# EAGLE board ALU (EAGLE 9.6.2), part 1 of 2
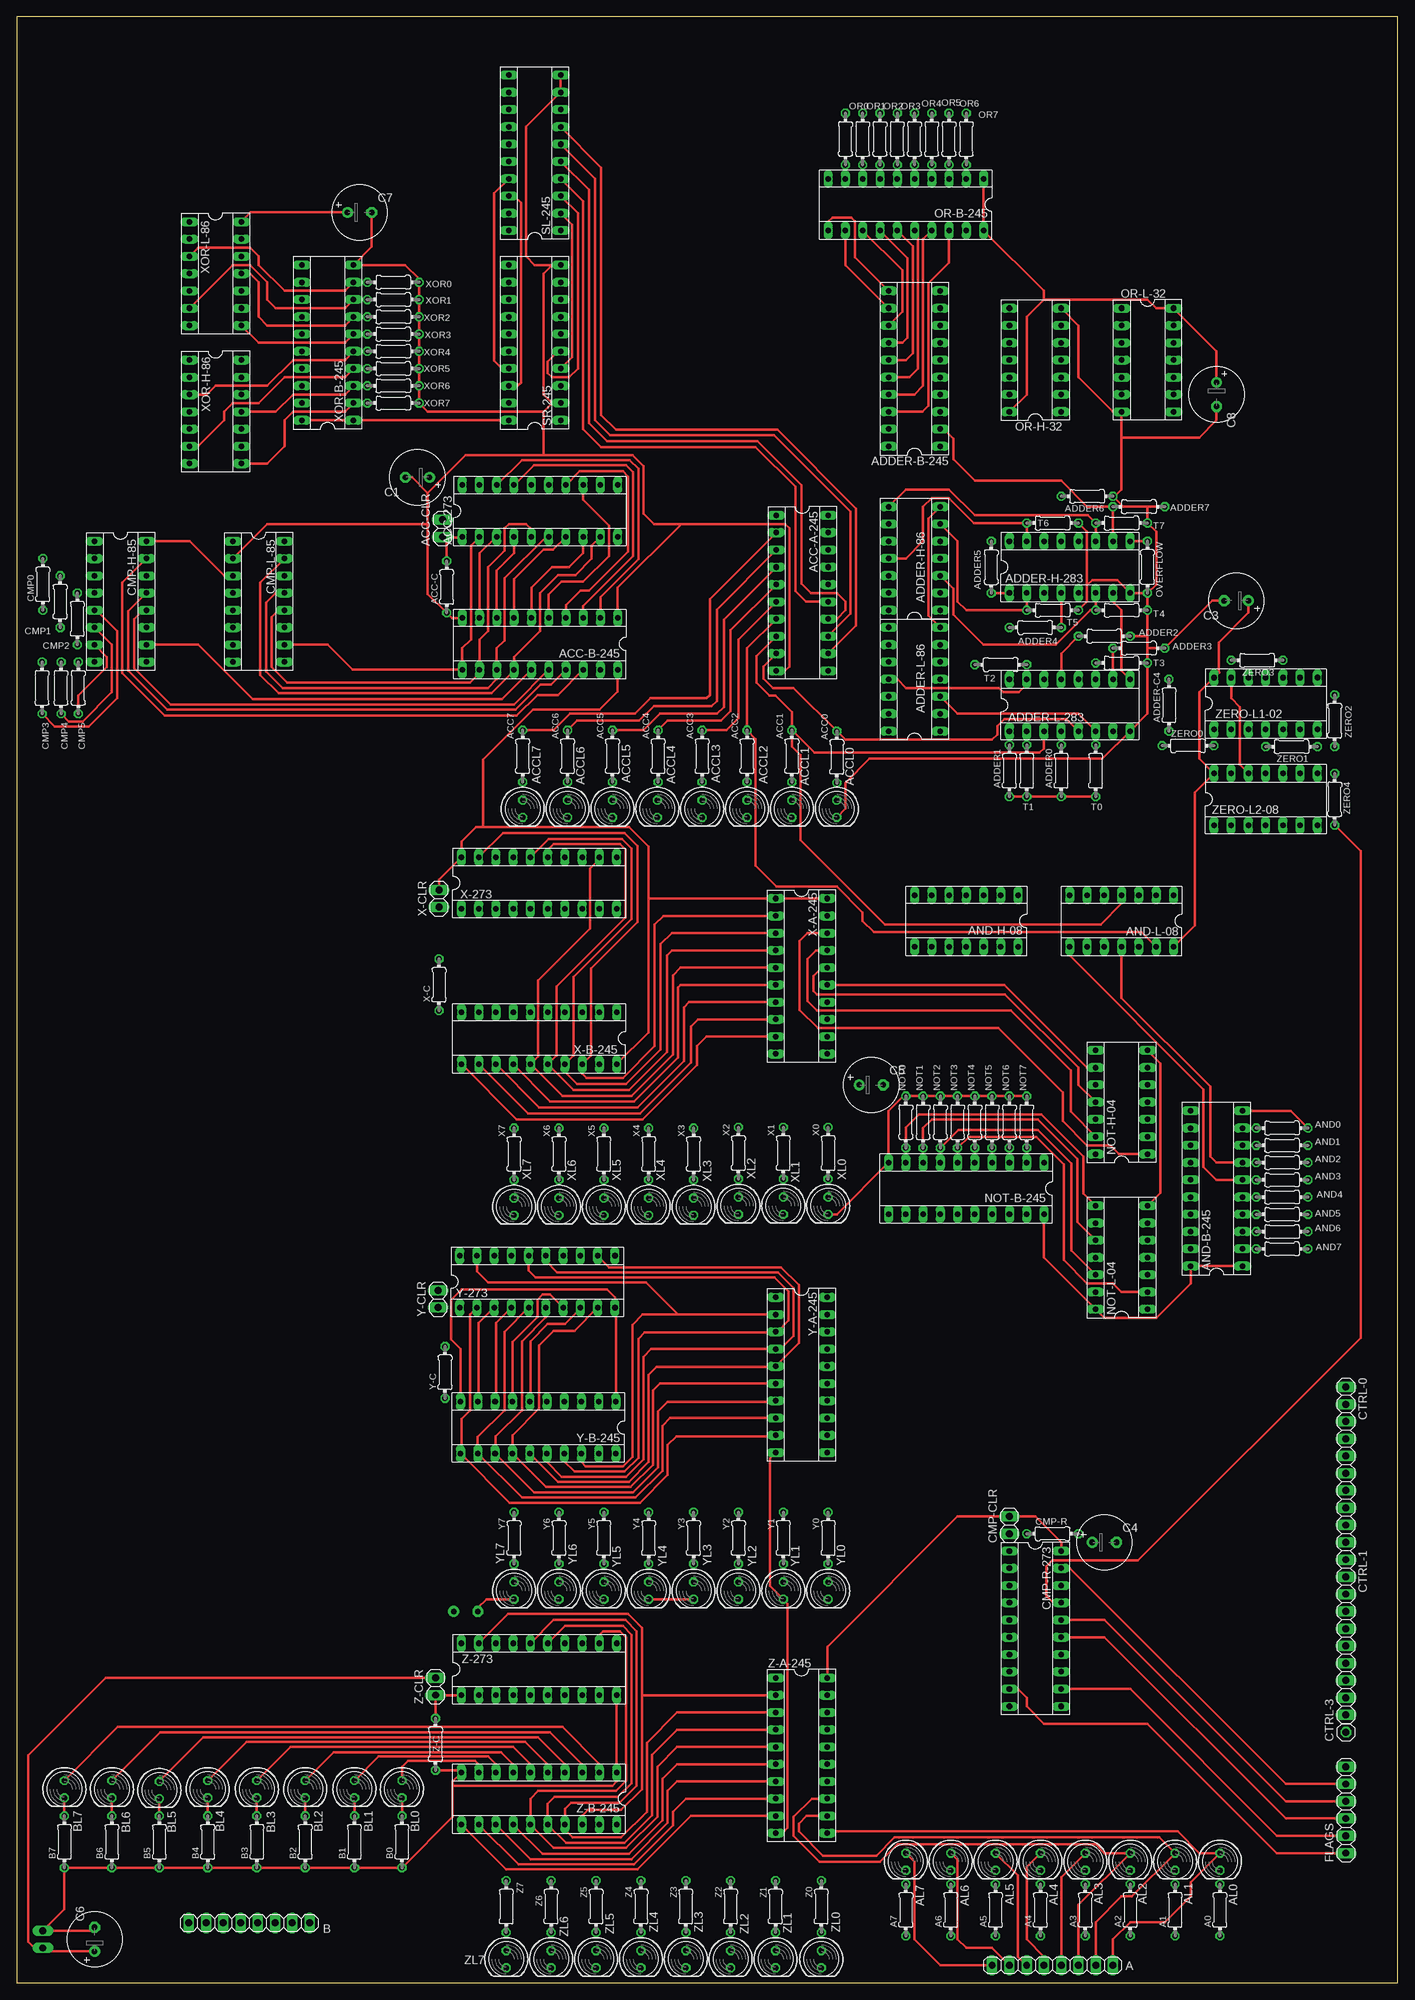
[diagram p8: board, top side]
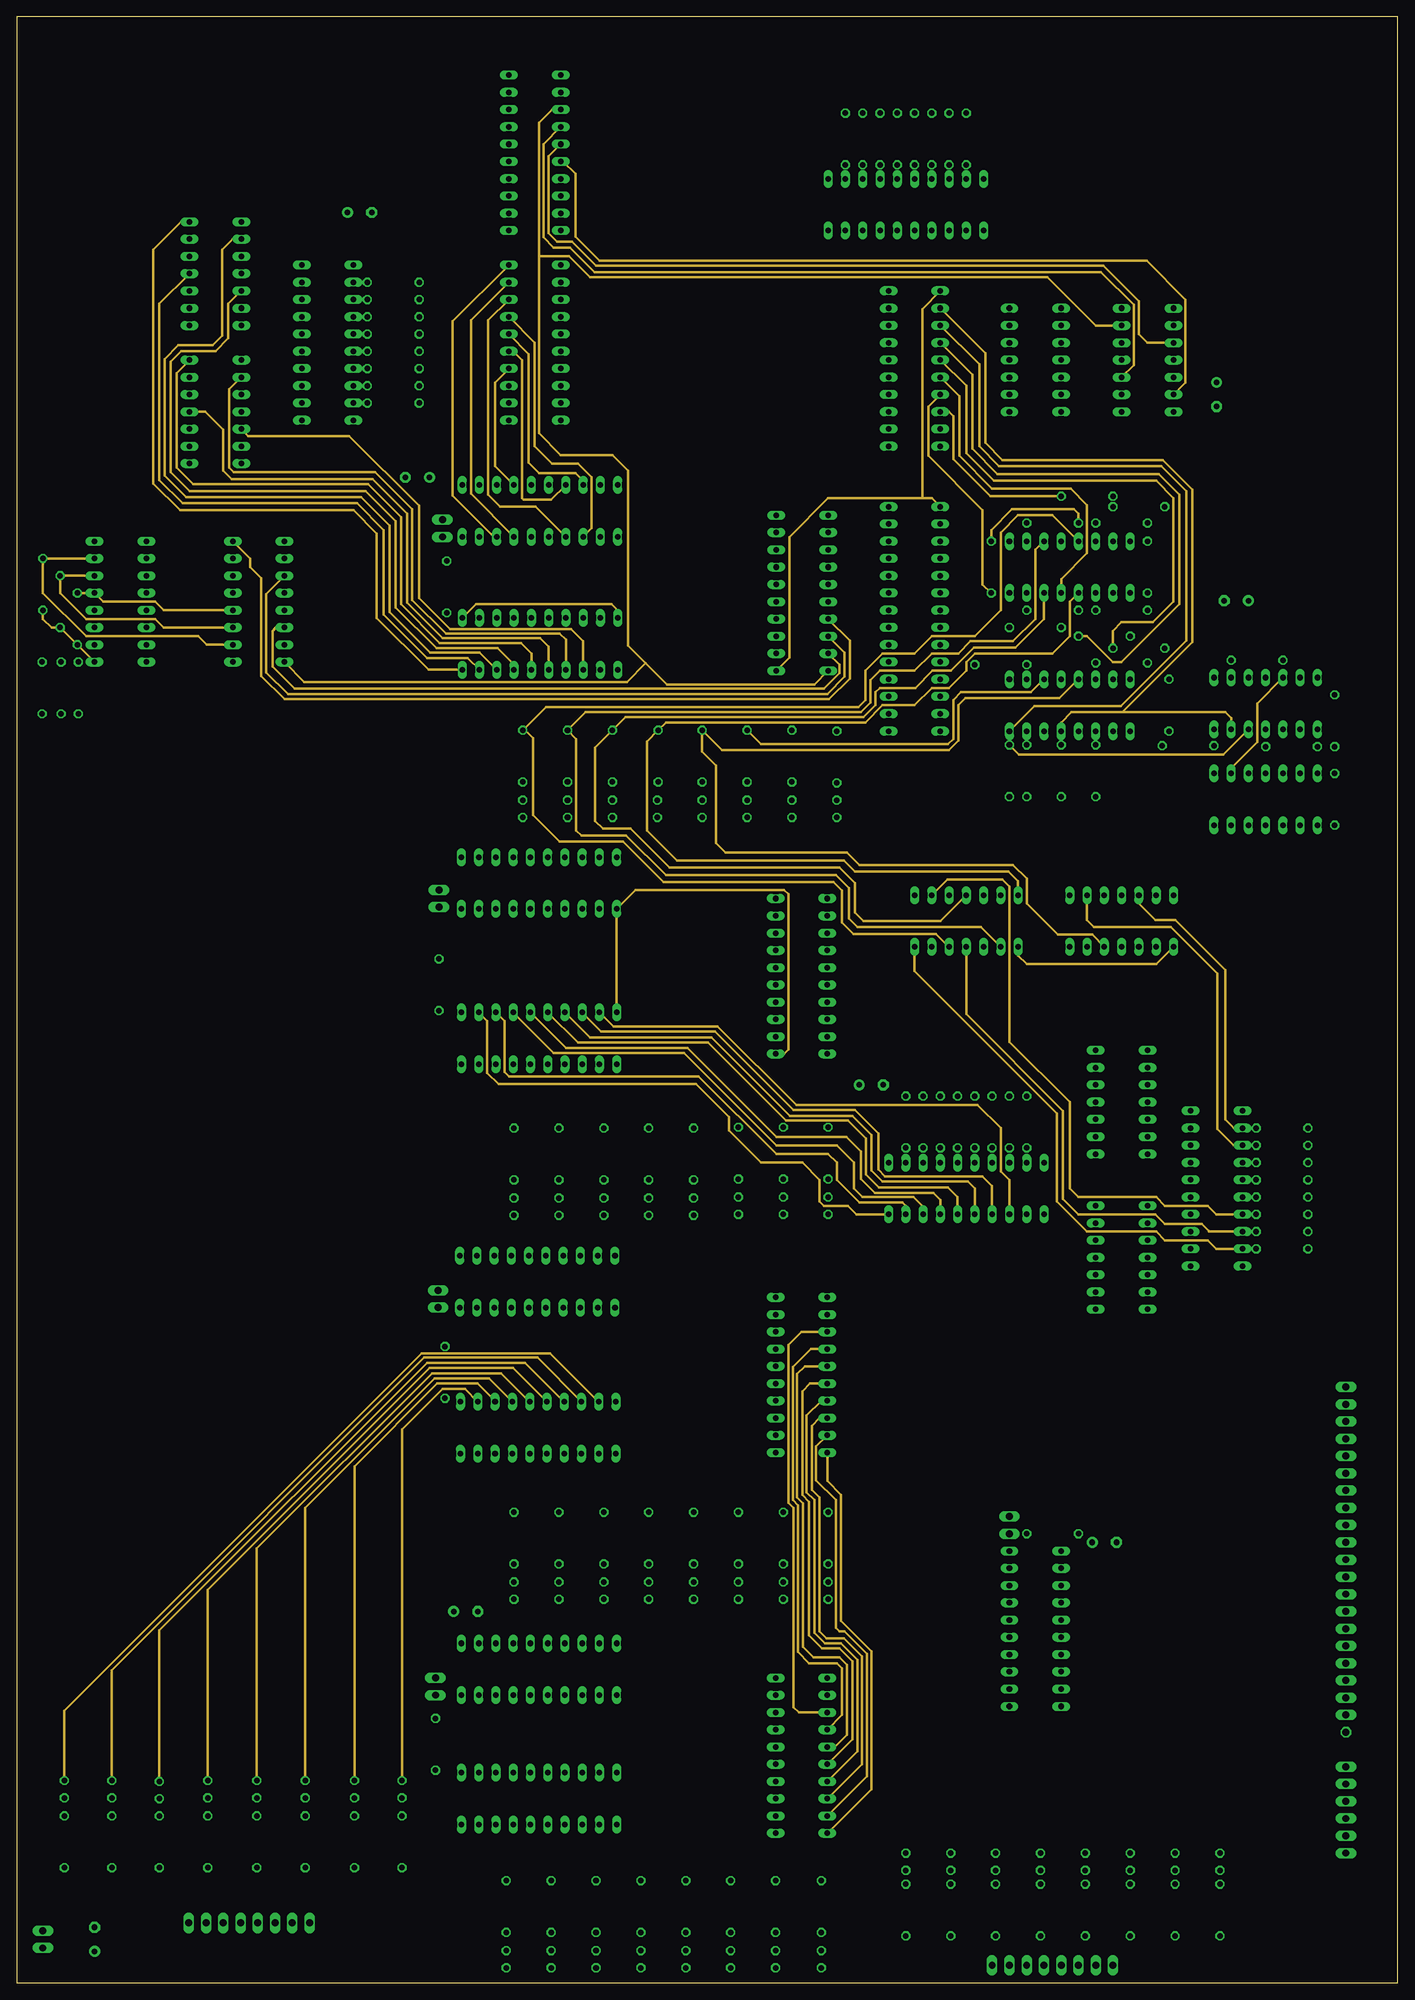
[diagram p9: board, inner layer Route2]
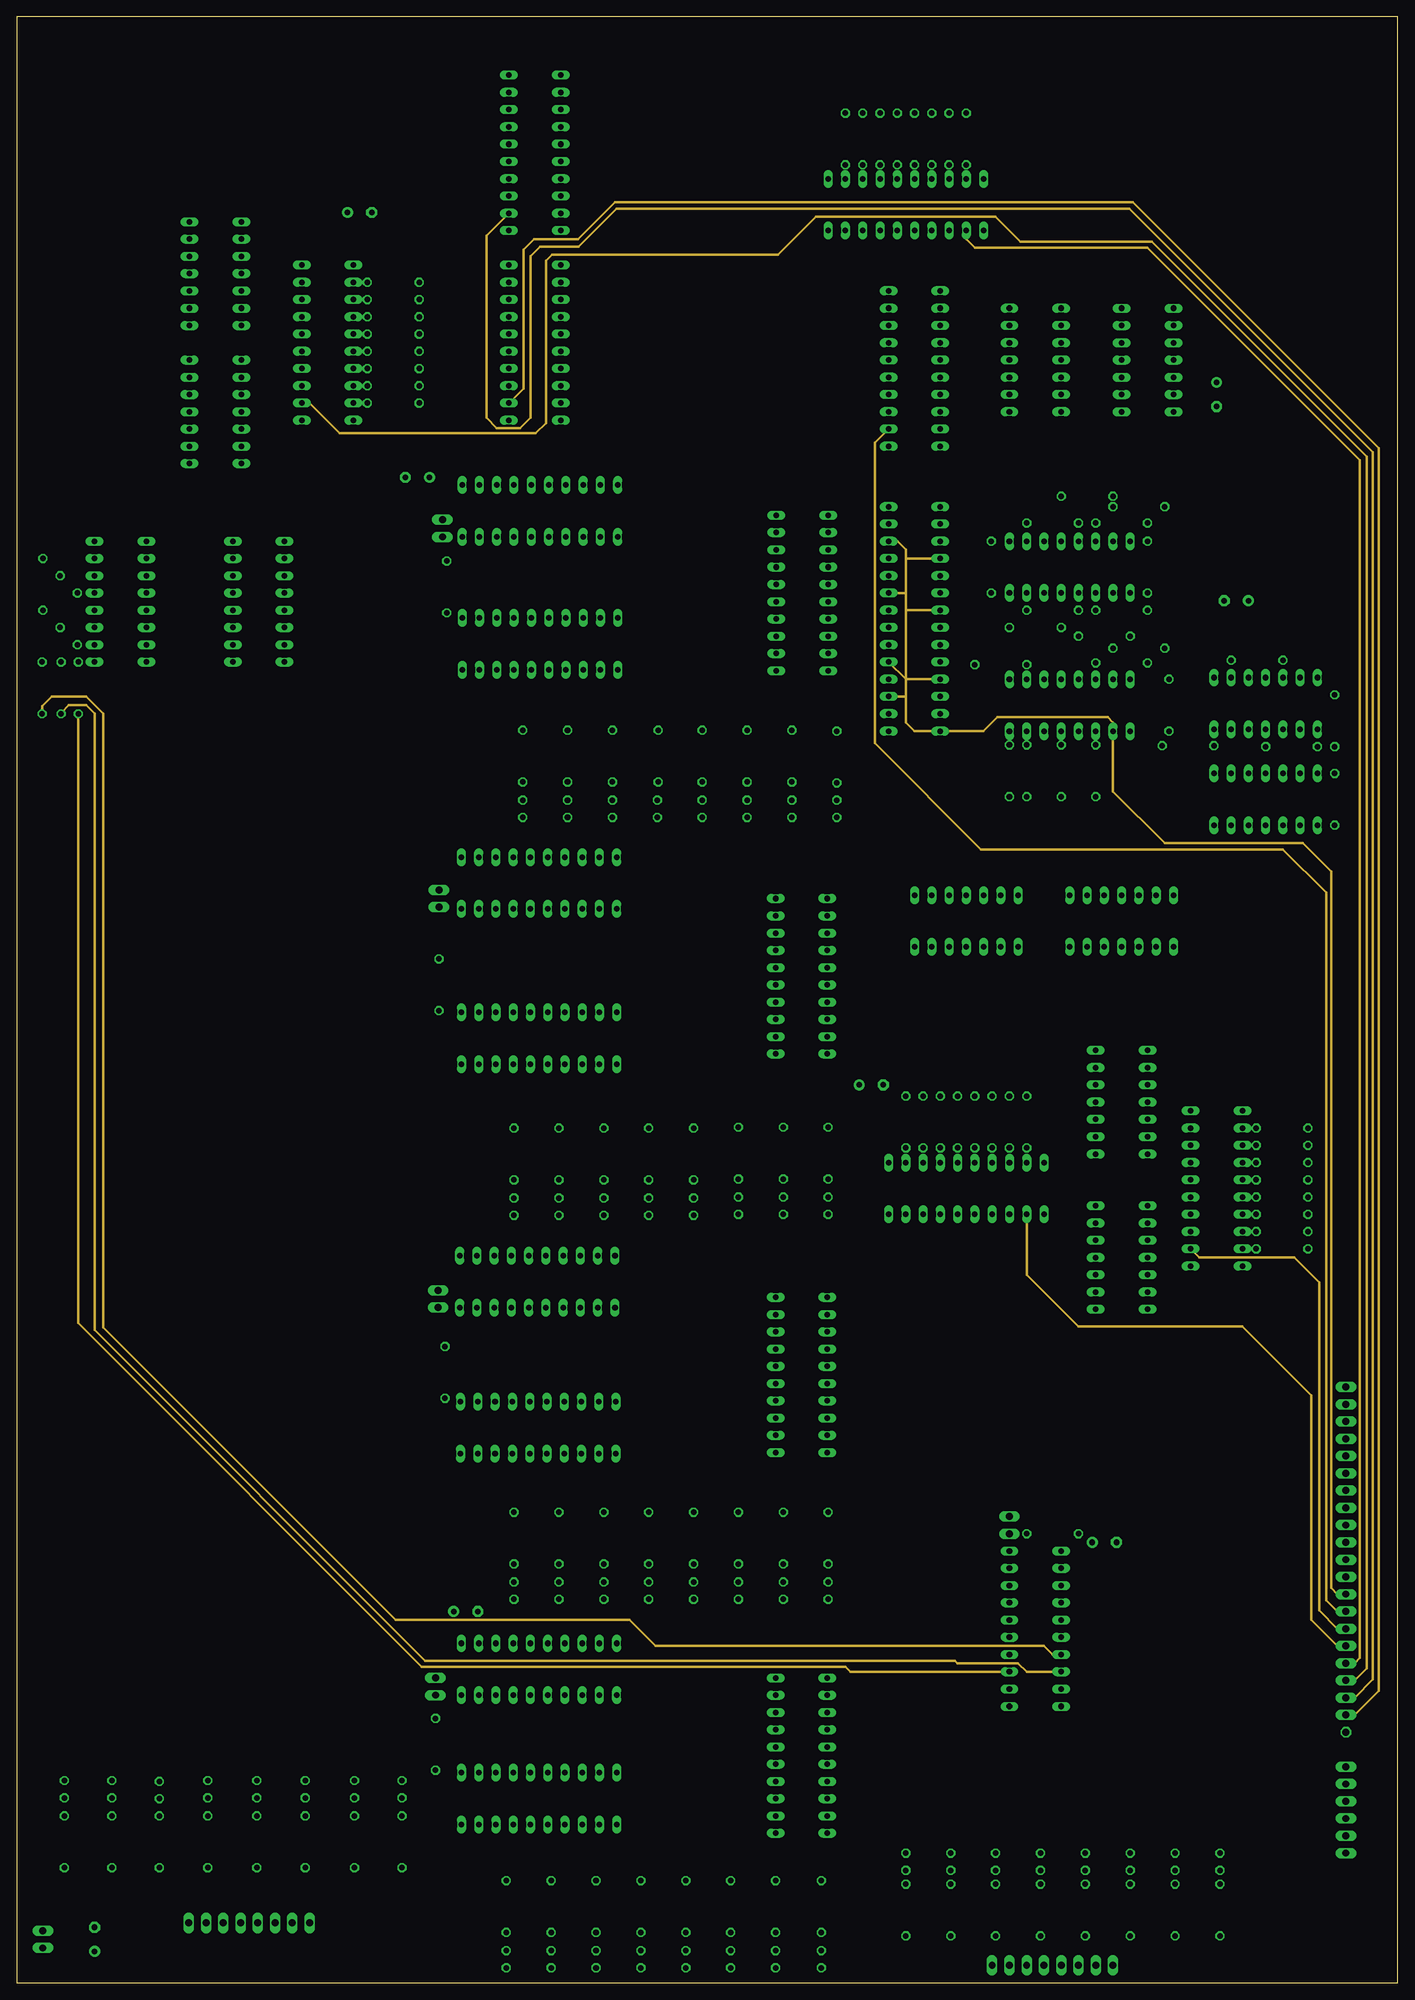
[diagram p10: board, inner layer Route3]
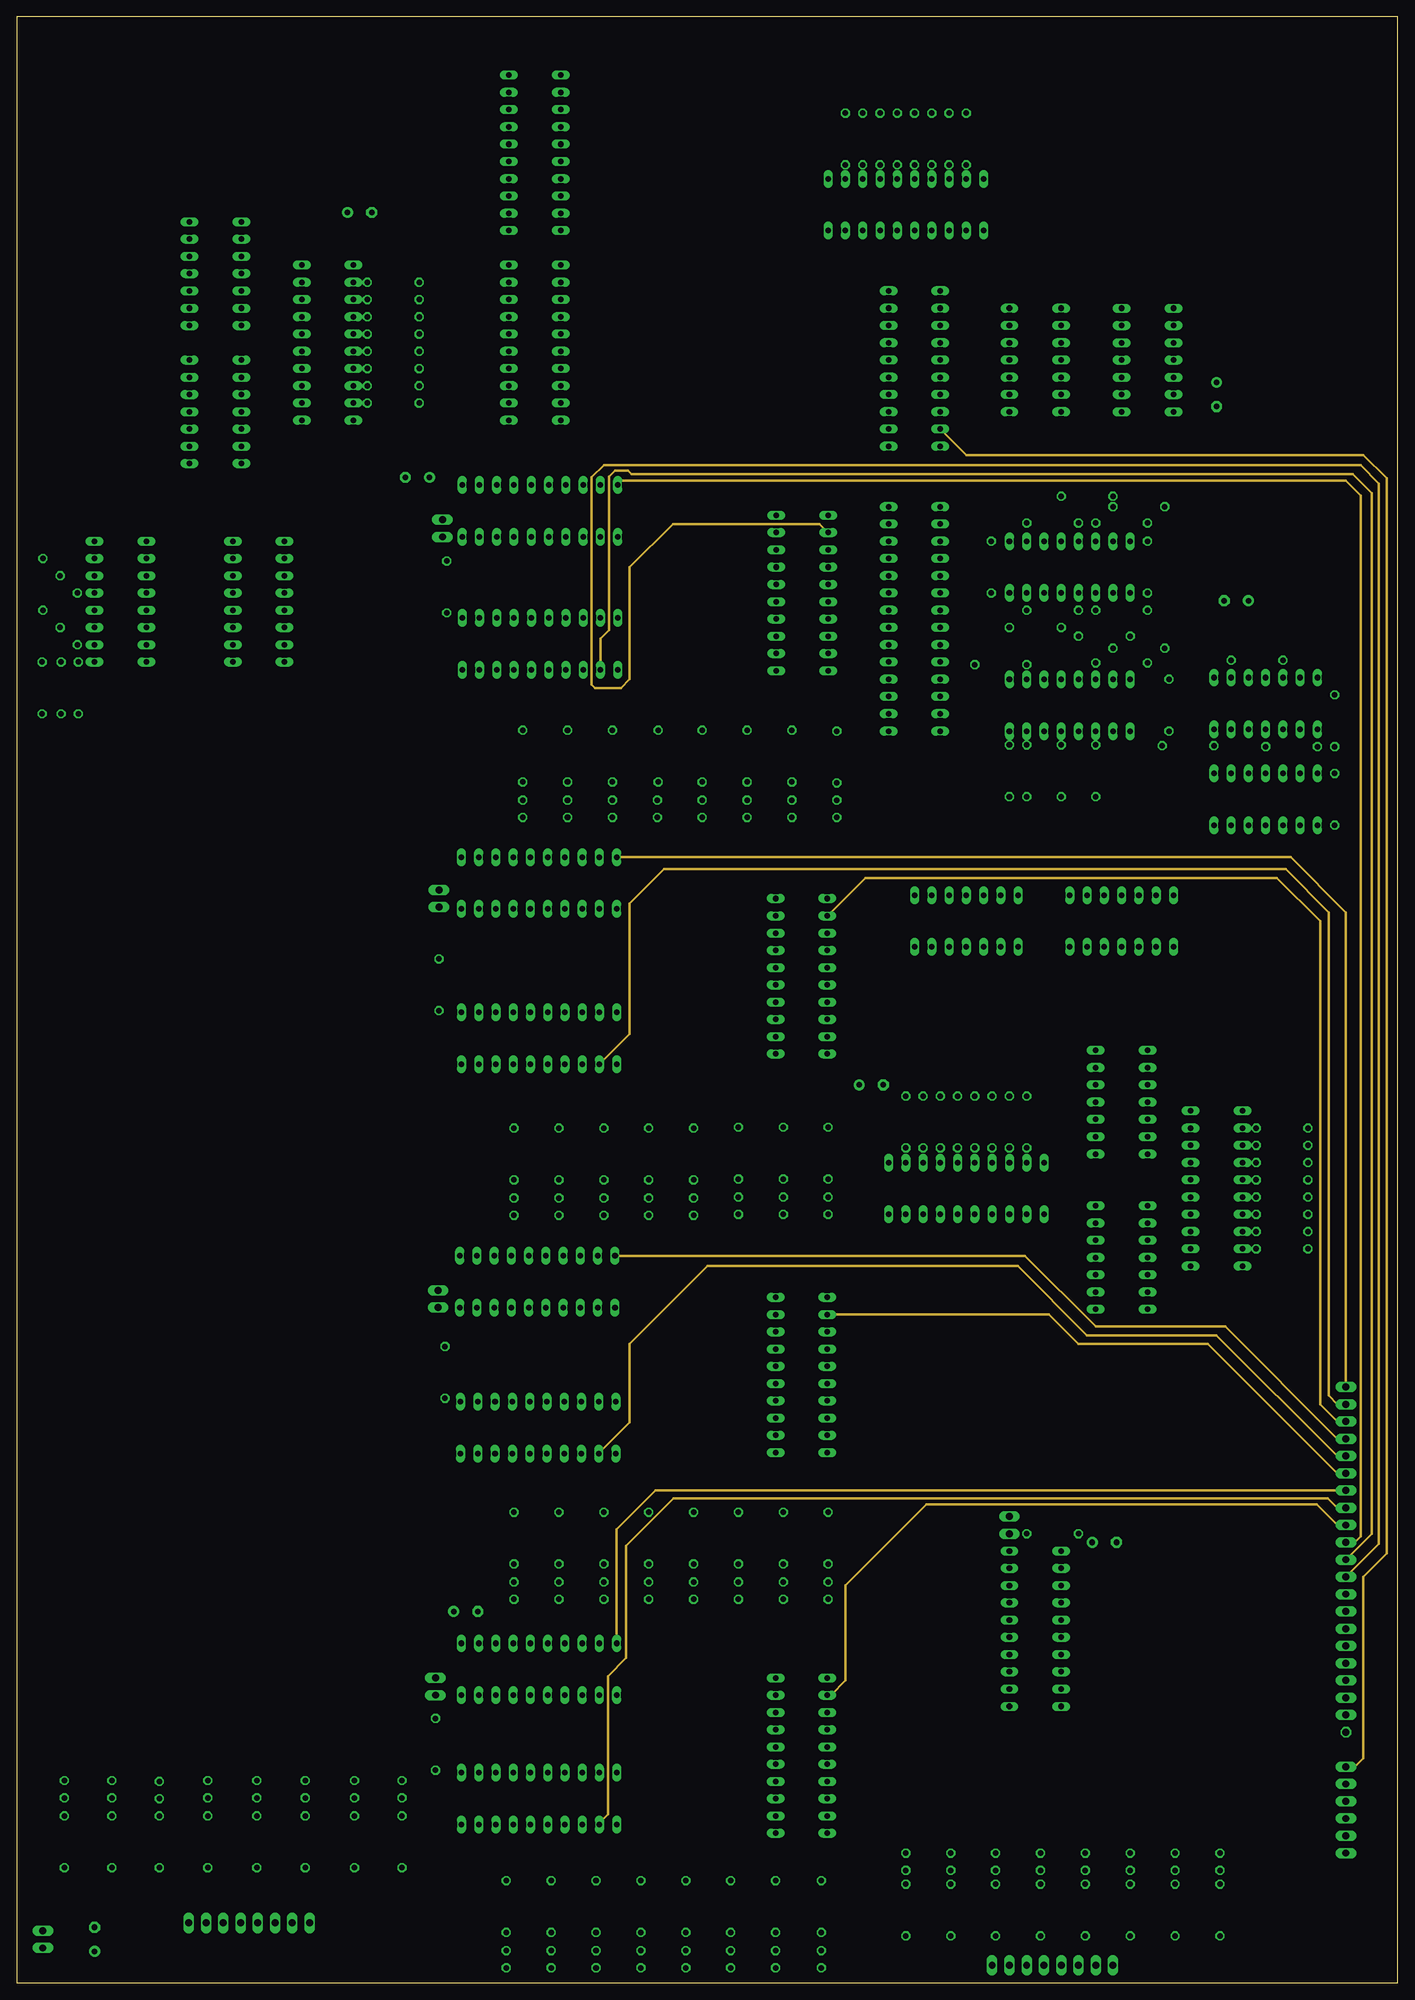
[diagram p11: board, inner layer Route14]
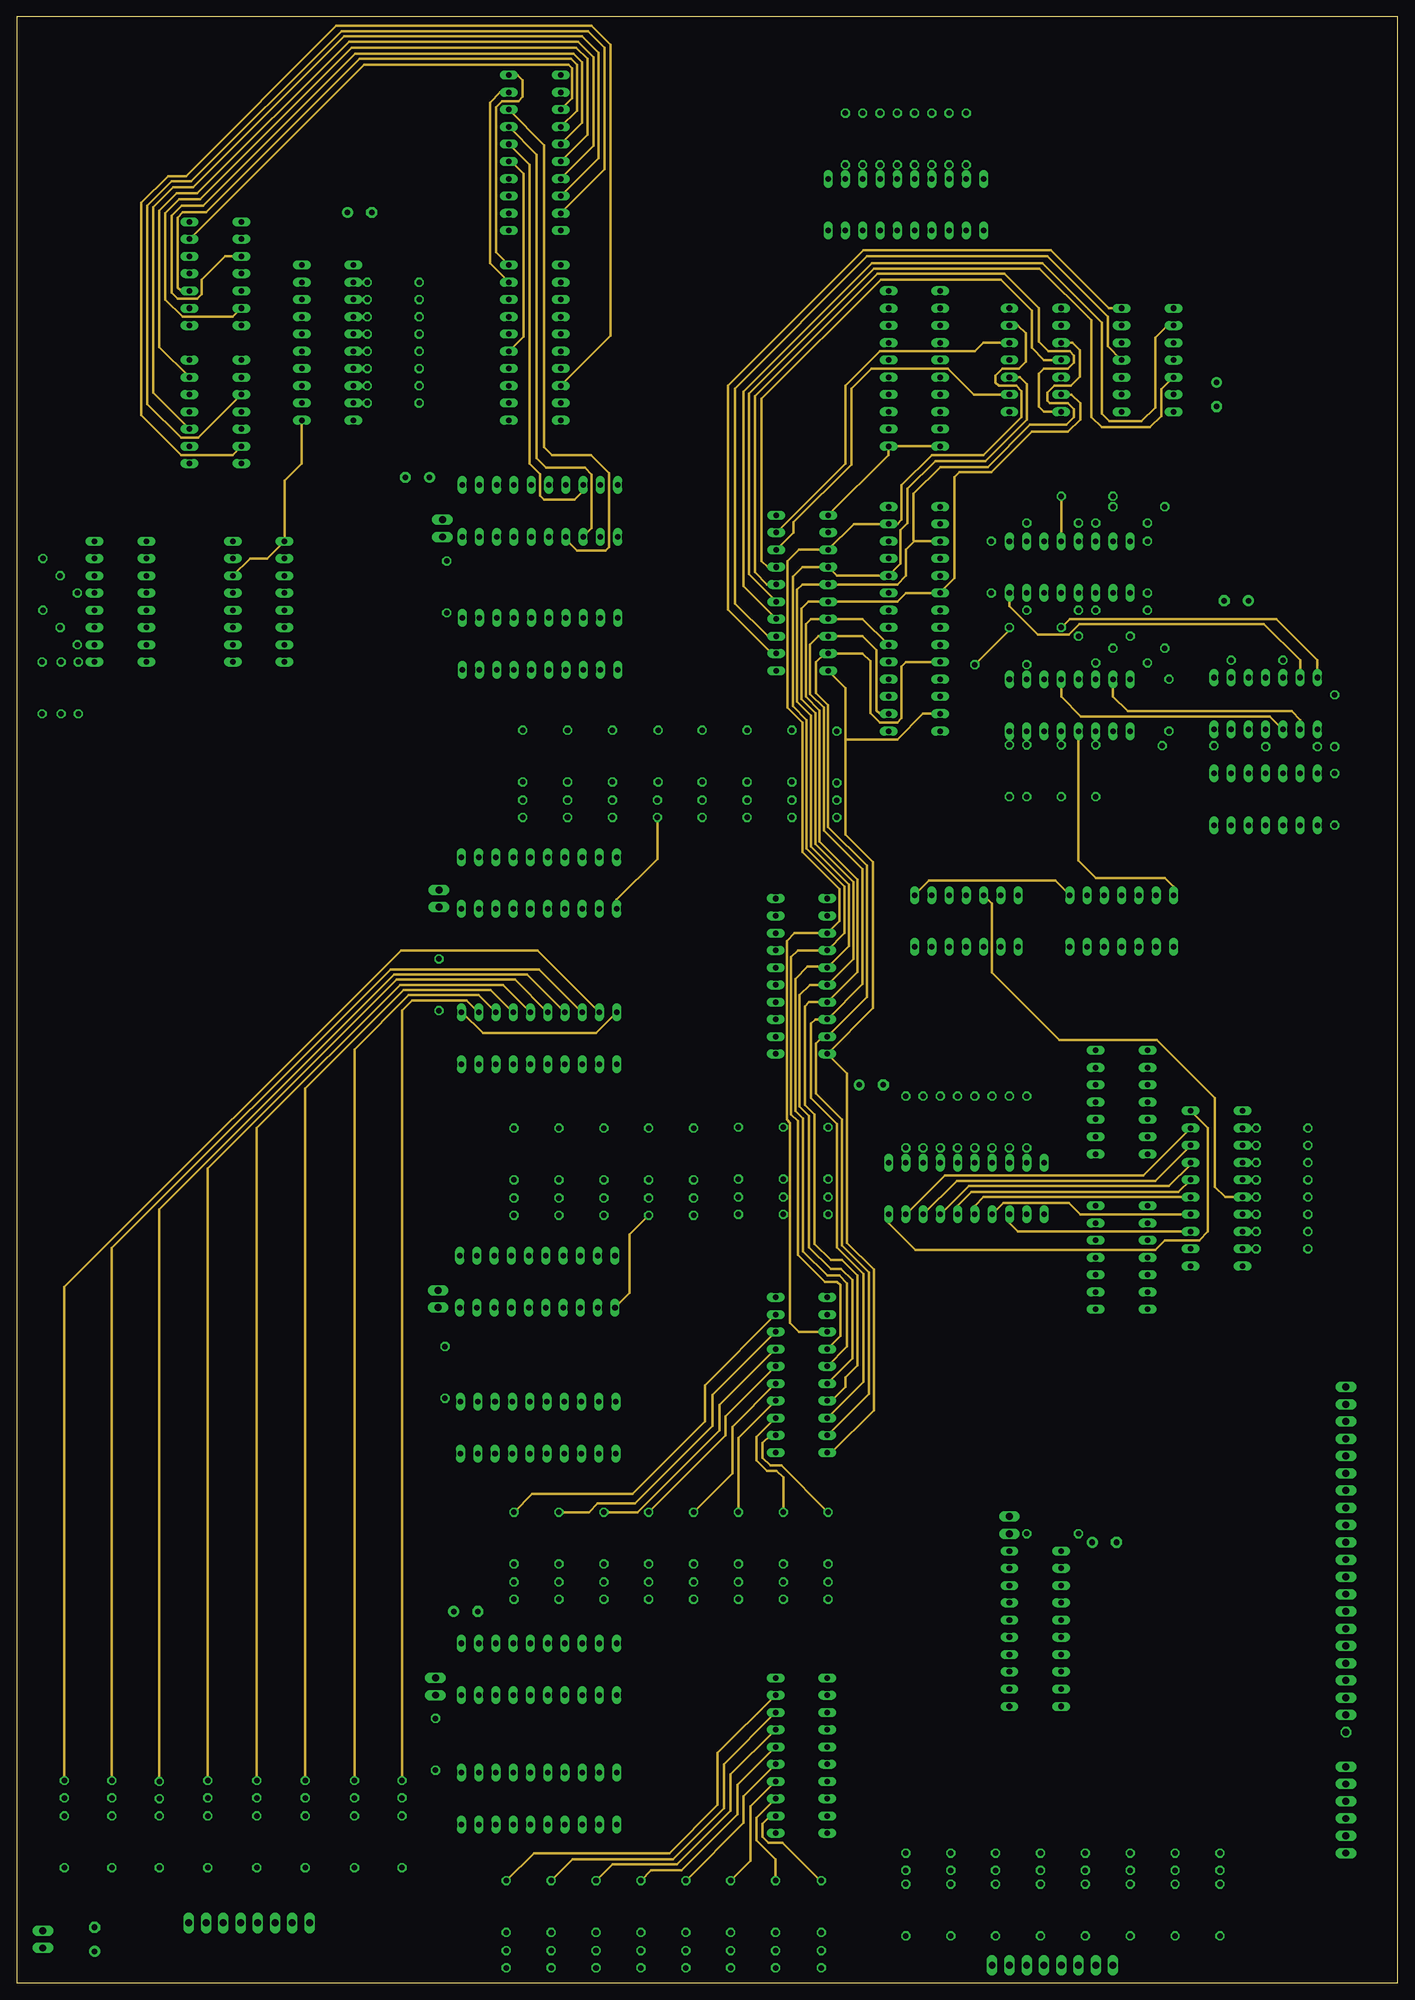
[diagram p12: board, inner layer Route15]
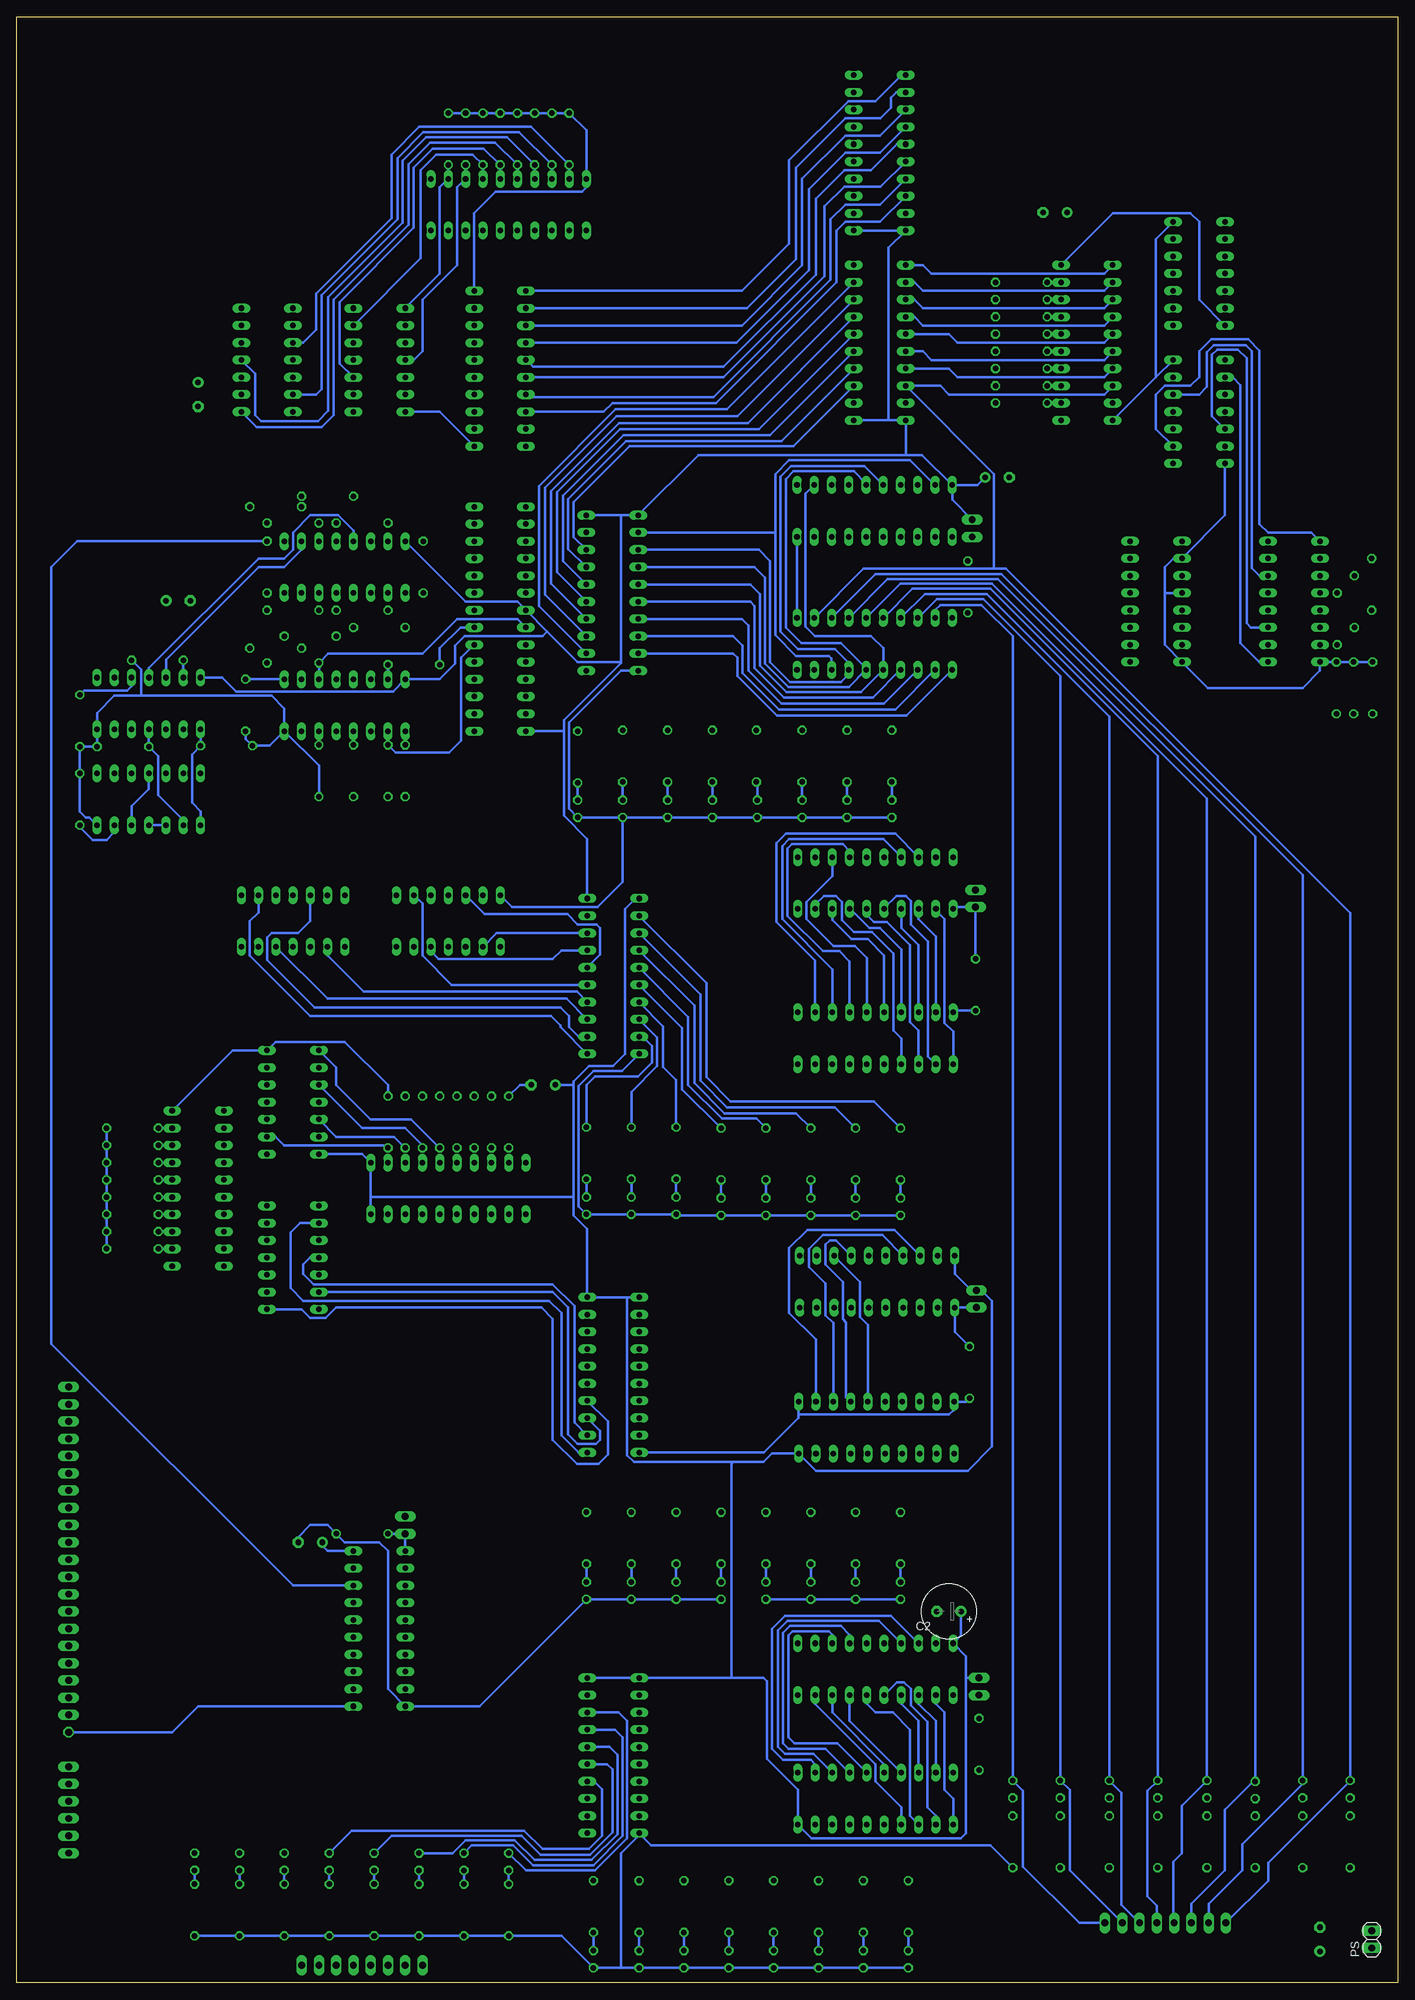
[diagram p13: board, bottom side, seen from below]

Size 203.18 x 289.23 mm. Coordinates in mm from the lower left corner, seen from the top.
Outline: 0,0 203.18,0 203.18,289.23 0,289.23 0,0
Copper layers (1+2*3+14*15+16): Top 0.035mm / dielectric 0.1mm / Route2 0.0175mm / dielectric 0.665mm / Route3 0.0175mm / dielectric 0.2mm / Route14 0.0175mm / dielectric 0.665mm / Route15 0.0175mm / dielectric 0.1mm / Bottom 0.035mm
Design rules "default *": minimum track width 6mil, minimum drill 0.35mm, track to track 6mil, track to pad 6mil, pad to pad 6mil, via to via 6mil, smd to smd 6mil, copper to edge 40mil, drill to drill 6mil, minimum pad ring 10mil, minimum via ring 8mil, stop-mask expansion 4mil, vias tented up to drill 0mil, thermal gap 10mil

## Footprints (pad centres in the part's own frame; a part is rotated, then mirrored left to right if it is on the bottom)
1X08 = drill 1.016 long: 1 -8.89,0; 2 -6.35,0; 3 -3.81,0; 4 -1.27,0; 5 1.27,0; 6 3.81,0; 7 6.35,0; 8 8.89,0
0204/7 = drill 0.813 octagon: 1 -3.81,0; 2 3.81,0
SOCKET-20 = drill 0.813 long: 1 -11.43,-3.81; 2 -8.89,-3.81; 3 -6.35,-3.81; 4 -3.81,-3.81; 5 -1.27,-3.81; 6 1.27,-3.81; 7 3.81,-3.81; 8 6.35,-3.81; 9 8.89,-3.81; 10 11.43,-3.81; 11 11.43,3.81; 12 8.89,3.81; 13 6.35,3.81; 14 3.81,3.81; 15 1.27,3.81; 16 -1.27,3.81; 17 -3.81,3.81; 18 -6.35,3.81; 19 -8.89,3.81; 20 -11.43,3.81
1X02 = drill 1.016 long: 1 -1.27,0; 2 1.27,0
LED5MM = drill 0.813 octagon: A -1.27,0; K 1.27,0
SOCKET-14 = drill 0.813 long: 1 -7.62,-3.81; 2 -5.08,-3.81; 3 -2.54,-3.81; 4 0,-3.81; 5 2.54,-3.81; 6 5.08,-3.81; 7 7.62,-3.81; 8 7.62,3.81; 9 5.08,3.81; 10 2.54,3.81; 11 0,3.81; 12 -2.54,3.81; 13 -5.08,3.81; 14 -7.62,3.81
SOCKET-16 = drill 0.813 long: 1 -8.89,-3.81; 2 -6.35,-3.81; 3 -3.81,-3.81; 4 -1.27,-3.81; 5 1.27,-3.81; 6 3.81,-3.81; 7 6.35,-3.81; 8 8.89,-3.81; 9 8.89,3.81; 10 6.35,3.81; 11 3.81,3.81; 12 1.27,3.81; 13 -1.27,3.81; 14 -3.81,3.81; 15 -6.35,3.81; 16 -8.89,3.81
E3,5-8 = drill 0.813 pad 1.6: + -1.778,0 | drill 0.813 pad 1.6 octagon: - 1.778,0
1X10 = drill 1.016 long: 1 -11.43,0; 2 -8.89,0; 3 -6.35,0; 4 -3.81,0; 5 -1.27,0; 6 1.27,0; 7 3.81,0; 8 6.35,0; 9 8.89,0; 10 11.43,0
1X01 = drill 1.016 octagon: 1 0,0
1X06 = drill 1.016 long: 1 -6.35,0; 2 -3.81,0; 3 -1.27,0; 4 1.27,0; 5 3.81,0; 6 6.35,0

## Placement (x,y rotation side)
A  [1X08]  152.4,2.54 0 top
A0  220  [0204/7]  177.04,10.67 90 top
A1  220  [0204/7]  170.43,10.67 90 top
A2  220  [0204/7]  163.83,10.67 90 top
A3  220  [0204/7]  157.23,10.67 90 top
A4  220  [0204/7]  150.62,10.67 90 top
A5  220  [0204/7]  144.02,10.67 90 top
A6  220  [0204/7]  137.41,10.67 90 top
A7  220  [0204/7]  130.81,10.67 90 top
ACC0  220  [0204/7]  120.65,180.34 90 top
ACC1  220  [0204/7]  114.05,180.47 90 top
ACC2  220  [0204/7]  107.44,180.47 90 top
ACC3  220  [0204/7]  100.84,180.47 90 top
ACC4  220  [0204/7]  94.36,180.47 90 top
ACC5  220  [0204/7]  87.63,180.47 90 top
ACC6  220  [0204/7]  81.03,180.47 90 top
ACC7  220  [0204/7]  74.42,180.47 90 top
ACC-273  [SOCKET-20]  76.96,216.53 0 top
ACC-A-245  [SOCKET-20]  115.57,204.47 270 top
ACC-B-245  [SOCKET-20]  76.96,196.98 180 top
ACC-C  [0204/7]  63.25,205.36 90 top
ACC-CLR  [1X02]  62.61,214 90 top
ACCL0  RED  [LED5MM]  120.65,172.72 270 top
ACCL1  RED  [LED5MM]  114.05,172.72 270 top
ACCL2  RED  [LED5MM]  107.44,172.72 270 top
ACCL3  RED  [LED5MM]  100.84,172.72 270 top
ACCL4  RED  [LED5MM]  94.23,172.72 270 top
ACCL5  RED  [LED5MM]  87.63,172.72 270 top
ACCL6  RED  [LED5MM]  81.03,172.72 270 top
ACCL7  RED  [LED5MM]  74.42,172.72 270 top
ADDER0  1k  [0204/7]  153.67,178.31 90 top
ADDER1  1k  [0204/7]  146.05,178.31 90 top
ADDER2  1k  [0204/7]  160.02,198.12 180 top
ADDER3  1k  [0204/7]  165.1,196.34 180 top
ADDER4  1k  [0204/7]  149.86,199.39 0 top
ADDER5  1k  [0204/7]  143.38,208.28 270 top
ADDER6  1k  [0204/7]  157.48,218.69 180 top
ADDER7  1k  [0204/7]  165.1,217.17 180 top
ADDER-B-245  [SOCKET-20]  132.08,237.49 90 top
ADDER-C4  1k  [0204/7]  169.54,187.96 90 top
ADDER-H-86  [SOCKET-14]  132.08,209.55 90 top
ADDER-H-283  [SOCKET-16]  154.94,208.28 0 top
ADDER-L-86  [SOCKET-14]  132.08,191.77 90 top
ADDER-L-283  [SOCKET-16]  154.94,187.96 0 top
AL0  RED  [LED5MM]  177.04,17.78 270 top
AL1  RED  [LED5MM]  170.43,17.78 270 top
AL2  RED  [LED5MM]  163.83,17.78 270 top
AL3  RED  [LED5MM]  157.23,17.78 270 top
AL4  RED  [LED5MM]  150.62,17.78 270 top
AL5  RED  [LED5MM]  144.02,17.78 270 top
AL6  RED  [LED5MM]  137.41,17.78 270 top
AL7  RED  [LED5MM]  130.81,17.78 270 top
AND0  1k  [0204/7]  186.18,125.73 180 top
AND1  1k  [0204/7]  186.18,123.19 180 top
AND2  1k  [0204/7]  186.18,120.65 180 top
AND3  1k  [0204/7]  186.18,118.11 180 top
AND4  1k  [0204/7]  186.18,115.57 180 top
AND5  1k  [0204/7]  186.18,113.03 180 top
AND6  1k  [0204/7]  186.18,110.49 180 top
AND7  1k  [0204/7]  186.18,107.95 180 top
AND-B-245  [SOCKET-20]  176.53,116.84 90 top
AND-H-08  [SOCKET-14]  139.7,156.21 180 top
AND-L-08  [SOCKET-14]  162.56,156.21 180 top
B  [1X08]  34.16,8.76 0 top
B0  220  [0204/7]  56.64,20.7 90 top
B1  220  [0204/7]  49.66,20.7 90 top
B2  220  [0204/7]  42.42,20.7 90 top
B3  220  [0204/7]  35.31,20.7 90 top
B4  220  [0204/7]  28.07,20.7 90 top
B5  220  [0204/7]  20.95,20.7 90 top
B6  220  [0204/7]  13.97,20.7 90 top
B7  220  [0204/7]  6.99,20.7 90 top
BL0  RED  [LED5MM]  56.64,28.45 270 top
BL1  RED  [LED5MM]  49.66,28.45 270 top
BL2  RED  [LED5MM]  42.42,28.45 270 top
BL3  RED  [LED5MM]  35.31,28.45 270 top
BL4  RED  [LED5MM]  28.07,28.45 270 top
BL5  RED  [LED5MM]  20.95,28.32 270 top
BL6  RED  [LED5MM]  13.97,28.45 270 top
BL7  RED  [LED5MM]  6.99,28.45 270 top
C1  [E3,5-8]  58.93,221.49 180 top
C2  [E3,5-8]  66.04,54.61 180 bottom
C3  [E3,5-8]  179.45,203.33 180 top
C4  [E3,5-8]  160.02,64.77 0 top
C5  [E3,5-8]  125.73,132.08 0 top
C6  [E3,5-8]  11.43,6.35 90 top
C7  [E3,5-8]  50.42,260.48 0 top
C8  [E3,5-8]  176.53,233.68 270 top
CMP0  1k  [0204/7]  3.81,205.74 90 top
CMP1  1k  [0204/7]  6.35,203.2 90 top
CMP2  1k  [0204/7]  8.89,200.66 90 top
CMP3  1k  [0204/7]  3.68,190.5 270 top
CMP4  1k  [0204/7]  6.48,190.5 270 top
CMP5  1k  [0204/7]  9.02,190.5 270 top
CMP-CLR  [1X02]  146.05,67.31 90 top
CMP-H-85  [SOCKET-16]  15.24,203.2 270 top
CMP-L-85  [SOCKET-16]  35.56,203.2 270 top
CMP-R  1k  [0204/7]  152.4,66.04 0 top
CMP-R-273  [SOCKET-20]  149.86,52.07 270 top
CTRL-0  [1X10]  195.58,76.2 270 top
CTRL-1  [1X10]  195.58,50.8 270 top
CTRL-3  [1X01]  195.58,36.83 90 top
FLAGS  [1X06]  195.58,25.4 90 top
NOT0  1k  [0204/7]  130.81,126.62 270 top
NOT1  1k  [0204/7]  133.35,126.62 270 top
NOT2  1k  [0204/7]  135.89,126.62 270 top
NOT3  1k  [0204/7]  138.43,126.62 270 top
NOT4  1k  [0204/7]  140.97,126.62 270 top
NOT5  1k  [0204/7]  143.51,126.62 270 top
NOT6  1k  [0204/7]  146.05,126.62 270 top
NOT7  1k  [0204/7]  148.59,126.62 270 top
NOT-B-245  [SOCKET-20]  139.7,116.84 180 top
NOT-H-04  [SOCKET-14]  162.56,129.54 90 top
NOT-L-04  [SOCKET-14]  162.56,106.68 90 top
OR0  1k  [0204/7]  121.92,271.27 270 top
OR1  1k  [0204/7]  124.46,271.27 270 top
OR2  1k  [0204/7]  127,271.27 270 top
OR3  1k  [0204/7]  129.54,271.27 270 top
OR4  1k  [0204/7]  132.08,271.27 270 top
OR5  1k  [0204/7]  134.62,271.27 270 top
OR6  1k  [0204/7]  137.16,271.27 270 top
OR7  1k  [0204/7]  139.7,271.27 270 top
OR-B-245  [SOCKET-20]  130.81,261.62 180 top
OR-H-32  [SOCKET-14]  149.86,238.76 90 top
OR-L-32  [SOCKET-14]  166.37,238.76 270 top
OVERFLOW  1k  [0204/7]  166.37,208.28 90 top
PS  [1X02]  3.81,6.35 90 bottom
SL-245  [SOCKET-20]  76.2,269.24 90 top
SR-245  [SOCKET-20]  76.2,241.3 90 top
T0  1k  [0204/7]  158.75,178.31 90 top
T1  1k  [0204/7]  148.59,178.31 90 top
T2  1k  [0204/7]  144.78,193.93 0 top
T3  1k  [0204/7]  162.56,194.18 180 top
T4  1k  [0204/7]  162.56,201.93 180 top
T5  1k  [0204/7]  152.4,201.93 180 top
T6  1k  [0204/7]  152.4,214.76 180 top
T7  1k  [0204/7]  162.56,214.76 180 top
X0  220  [0204/7]  119.38,122.05 90 top
X1  220  [0204/7]  112.78,122.05 90 top
X2  220  [0204/7]  106.17,122.05 90 top
X3  220  [0204/7]  99.57,121.92 90 top
X4  220  [0204/7]  92.96,121.92 90 top
X5  220  [0204/7]  86.36,121.92 90 top
X6  220  [0204/7]  79.76,121.92 90 top
X7  220  [0204/7]  73.15,121.92 90 top
X-273  [SOCKET-20]  76.83,161.8 0 top
X-A-245  [SOCKET-20]  115.44,148.08 270 top
X-B-245  [SOCKET-20]  76.83,138.94 180 top
X-C  [0204/7]  62.1,146.81 90 top
X-CLR  [1X02]  62.1,159.51 90 top
XL0  RED  [LED5MM]  119.38,114.3 270 top
XL1  RED  [LED5MM]  112.78,114.3 270 top
XL2  RED  [LED5MM]  106.17,114.3 270 top
XL3  RED  [LED5MM]  99.57,114.17 270 top
XL4  RED  [LED5MM]  92.96,114.17 270 top
XL5  RED  [LED5MM]  86.36,114.17 270 top
XL6  RED  [LED5MM]  79.76,114.17 270 top
XL7  RED  [LED5MM]  73.15,114.17 270 top
XOR0  1k  [0204/7]  55.37,250.19 180 top
XOR1  1k  [0204/7]  55.37,247.65 180 top
XOR2  1k  [0204/7]  55.37,245.11 180 top
XOR3  1k  [0204/7]  55.37,242.57 180 top
XOR4  1k  [0204/7]  55.37,240.03 180 top
XOR5  1k  [0204/7]  55.37,237.49 180 top
XOR6  1k  [0204/7]  55.37,234.95 180 top
XOR7  1k  [0204/7]  55.37,232.41 180 top
XOR-B-245  [SOCKET-20]  45.72,241.3 90 top
XOR-H-86  [SOCKET-14]  29.21,231.14 270 top
XOR-L-86  [SOCKET-14]  29.21,251.46 270 top
Y0  220  [0204/7]  119.38,65.41 90 top
Y1  220  [0204/7]  112.78,65.41 90 top
Y2  220  [0204/7]  106.17,65.41 90 top
Y3  220  [0204/7]  99.57,65.41 90 top
Y4  220  [0204/7]  92.96,65.41 90 top
Y5  220  [0204/7]  86.36,65.41 90 top
Y6  220  [0204/7]  79.76,65.41 90 top
Y7  220  [0204/7]  73.15,65.41 90 top
Y-273  [SOCKET-20]  76.58,103.12 0 top
Y-A-245  [SOCKET-20]  115.44,89.41 270 top
Y-B-245  [SOCKET-20]  76.71,81.66 180 top
Y-C  [0204/7]  62.99,89.79 90 top
Y-CLR  [1X02]  61.98,100.58 90 top
YL0  RED  [LED5MM]  119.38,57.66 270 top
YL1  RED  [LED5MM]  112.78,57.66 270 top
YL2  RED  [LED5MM]  106.17,57.66 270 top
YL3  RED  [LED5MM]  99.57,57.66 270 top
YL4  RED  [LED5MM]  92.96,57.66 270 top
YL5  RED  [LED5MM]  86.36,57.66 270 top
YL6  RED  [LED5MM]  79.76,57.66 270 top
YL7  RED  [LED5MM]  73.15,57.66 270 top
Z0  220  [0204/7]  118.36,11.18 90 top
Z1  220  [0204/7]  111.63,11.18 90 top
Z2  220  [0204/7]  105.03,11.18 90 top
Z3  220  [0204/7]  98.42,11.18 90 top
Z4  220  [0204/7]  91.82,11.18 90 top
Z5  220  [0204/7]  85.22,11.18 90 top
Z6  220  [0204/7]  78.61,11.18 90 top
Z7  220  [0204/7]  72.01,11.18 90 top
Z-273  [SOCKET-20]  76.83,46.1 0 top
Z-A-245  [SOCKET-20]  115.44,33.4 270 top
Z-B-245  [SOCKET-20]  76.83,27.05 180 top
Z-C  [0204/7]  61.59,35.05 90 top
Z-CLR  [1X02]  61.59,43.56 90 top
ZERO0  1k  [0204/7]  172.34,181.99 0 top
ZERO1  1k  [0204/7]  187.58,181.86 180 top
ZERO2  1k  [0204/7]  193.93,185.67 90 top
ZERO3  1k  [0204/7]  182.5,194.56 180 top
ZERO4  1k  [0204/7]  193.93,174.12 270 top
ZERO-L1-02  [SOCKET-14]  183.77,188.21 0 top
ZERO-L2-08  [SOCKET-14]  183.77,174.12 0 top
ZL0  RED  [LED5MM]  118.36,3.43 270 top
ZL1  RED  [LED5MM]  111.63,3.43 270 top
ZL2  RED  [LED5MM]  105.03,3.43 270 top
ZL3  RED  [LED5MM]  98.42,3.43 270 top
ZL4  RED  [LED5MM]  91.82,3.43 270 top
ZL5  RED  [LED5MM]  85.22,3.43 270 top
ZL6  RED  [LED5MM]  78.61,3.43 270 top
ZL7  RED  [LED5MM]  72.01,3.43 270 top

## Tracks (layer width: path | path; a pad name or v marks a point on that pad's centre or on a via)
A0
  Top 0.4: Z-A-245.11 119.51,22.23 170.81,22.23 173.99,19.05 AL0.A 172.72,14.73 172.72,12.7 168.91,8.89 163.83,8.89 161.29,6.35 A.8
  Route2 0.4: Z-A-245.11 125.73,28.45 125.73,48.77 121.28,53.21 121.28,71.75 119.25,73.79 Y-A-245.11 | SL-245.8 78.74,275.59 76.83,273.69 76.83,254 | 92.52,194.12 89.92,196.72 89.92,222.5 87.63,224.79 80.01,224.79 76.83,227.97 76.83,254 | 92.52,194.12 95.63,191.01 117.35,191.01 ACC-A-245.11 | OR-L-32.2 158.75,243.84 151.64,250.95 84.33,250.95 81.28,254 76.83,254 | CMP-L-85.9 42.29,191.39 89.79,191.39 92.52,194.12
  Route15 0.4: Y-A-245.11 119.89,77.98 126.11,84.2 126.11,104.9 122.17,108.84 122.17,133.73 X-A-245.11 125.98,143.38 125.98,164.85 121.92,168.91 121.92,182.75 | ACC-A-245.11 121.92,190.5 121.92,182.75 | ADDER-L-86.2 133.35,186.69 129.54,182.88 122.05,182.88 121.92,182.75 | SL-245.8 81.66,277.24 81.66,281.69 81.15,282.19 51.05,282.19 XOR-L-86.2
  Bottom 0.4: NOT-L-04.9 161.54,111.76 162.94,110.36 162.94,102.23 161.04,100.33 124.84,100.33 123.06,98.55 123.06,80.52 120.52,77.98 Y-A-245.11 | X-A-245.11 123.19,140.59 123.19,140.84 124.59,142.24 160.02,142.24 168.91,151.13 168.91,156.21 167.64,157.48 AND-L-08.2
A1
  Top 0.4: Z-A-245.12 116.2,24.51 115.06,23.37 115.06,22.23 118.62,18.67 126.49,18.67 129.16,21.34 168.15,21.34 AL1.A 164.08,12.7 162.56,12.7 158.75,8.89 A.7 | SL-245.7 85.98,267.08 85.98,230.63 88.14,228.47 111.89,228.47 123.44,216.92 123.44,199.64 ACC-A-245.12
  Route2 0.4: Z-A-245.12 125.09,30.35 125.09,48.39 121.79,51.69 121.03,51.69 120.52,52.2 120.52,70.99 117.6,73.91 117.6,78.87 Y-A-245.12 | SL-245.7 77.47,270.51 77.47,256.79 78.99,255.27 81.41,255.27 84.96,251.71 159.51,251.71 164.34,246.89 164.34,238 OR-L-32.5 | CMP-L-85.11 38.1,199.39 37.59,198.88 37.59,193.68 40.89,190.37 118.75,190.37 121.03,192.66 121.03,193.93 ACC-A-245.12
  Route15 0.4: Y-A-245.12 125.35,86.61 125.35,104.52 121.41,108.46 121.41,127 117.6,130.81 117.6,138.18 118.62,139.19 X-A-245.12 125.09,145.03 125.09,164.34 119.38,170.05 119.38,187.96 117.6,189.74 117.6,194.31 118.87,195.58 ACC-A-245.12 124.46,195.58 125.6,194.44 125.6,186.82 127,185.42 129.54,185.42 130.18,186.06 130.18,193.68 130.81,194.31 ADDER-L-86.5 | XOR-L-86.5 24.13,248.92 23.62,249.43 23.62,259.71 24.38,260.48 27.81,260.48 50.42,283.08 81.53,283.08 82.42,282.19 82.42,275.46 SL-245.7
  Bottom 0.4: SR-245.9 98.68,231.52 115.06,231.52 126.36,220.22 126.36,202.56 ACC-A-245.12 | NOT-L-04.11 160.02,106.68 161.04,105.66 161.04,104.27 159.51,102.74 124.33,102.74 121.16,99.57 121.16,82.42 Y-A-245.12 | AND-L-08.5 160.02,156.21 161.8,154.43 165.74,154.43 166.37,153.8 166.37,150.5 159.38,143.51 123.19,143.51 121.92,142.24 121.92,140.59 120.52,139.19 X-A-245.12
A2
  Top 0.4: Z-A-245.13 116.97,27.05 114.3,24.38 114.3,21.59 118.11,17.78 127,17.78 129.54,20.32 158.75,20.32 160.02,19.05 AL2.A 156.21,11.43 A.6 | SL-245.6 85.09,265.43 85.09,229.87 87.25,227.71 111.38,227.71 122.68,216.41 122.68,201.42 ACC-A-245.13
  Route2 0.4: Y-A-245.13 118.11,83.06 116.97,81.92 116.97,72.52 118.11,71.37 118.11,51.69 119.13,50.67 121.67,50.67 124.33,48.01 124.33,32.13 Z-A-245.13 | SL-245.6 78.23,268.73 78.23,257.43 79.5,256.16 81.66,256.16 85.22,252.6 159.89,252.6 165.1,247.4 165.1,242.57 166.37,241.3 OR-L-32.12 | ACC-A-245.13 121.79,195.71 121.79,192.15 119.25,189.61 39.88,189.61 36.7,192.79 36.7,204.34 CMP-L-85.14
  Route15 0.4: Y-A-245.13 124.59,88.39 124.59,104.27 120.65,108.2 120.65,126.36 116.84,130.18 116.84,141.1 117.47,141.73 X-A-245.13 124.46,146.94 124.46,163.83 118.75,169.54 118.75,187.58 116.71,189.61 116.71,196.85 117.98,198.12 ACC-A-245.13 124.46,198.12 126.49,196.09 126.49,187.2 127,186.69 ADDER-L-86.13 | SL-245.6 83.19,273.69 83.19,282.57 81.92,283.85 49.78,283.85 27.43,261.49 24.26,261.49 22.73,259.97 22.73,248.67 23.62,247.78 26.54,247.78 27.18,248.41 27.18,250.57 30.61,254 XOR-L-86.12
  Bottom 0.4: SR-245.8 97.16,230.5 114.94,230.5 125.48,219.96 125.48,204.22 ACC-A-245.13 | Y-A-245.13 117.35,81.15 117.35,79.88 117.98,79.25 120.65,79.25 122.05,80.64 122.05,99.31 124.33,101.6 NOT-L-04.13 | AND-L-08.12 157.48,144.78 122.3,144.78 X-A-245.13
A3
  Top 0.4: AL3.A 153.67,15.49 A.5 | SL-245.5 84.2,263.78 84.2,229.49 86.87,226.82 108.97,226.82 115.44,220.34 115.44,205.87 116.84,204.47 120.65,204.47 121.92,203.2 121.92,201.93 120.65,200.66 ACC-A-245.14
  Route2 0.4: Z-A-245.14 123.7,34.04 123.7,47.5 121.28,49.91 118.87,49.91 117.35,51.44 117.35,70.99 116.2,72.14 116.2,83.44 118.36,85.6 Y-A-245.14 | OR-L-32.9 171.96,235.46 171.96,247.65 166.24,253.37 85.72,253.37 82.17,256.92 82.17,266.19 80.39,267.97 SL-245.5 | ACC-A-245.14 122.56,197.49 122.56,191.9 119.51,188.85 39.37,188.85 35.94,192.28 35.94,206.63 34.29,208.28 34.29,209.55 CMP-L-85.1
  Route15 0.4: Y-A-245.14 119.89,85.6 121.92,87.63 121.92,89.03 123.7,90.81 123.7,104.01 121.41,106.3 119.76,106.3 117.35,108.71 117.35,127.76 115.95,129.16 115.95,143.64 116.59,144.27 X-A-245.14 123.7,148.72 123.7,162.31 118.11,167.89 118.11,187.2 116.08,189.23 116.08,199.9 116.84,200.66 ACC-A-245.14 124.46,200.66 ADDER-L-86.9 | XOR-L-86.9 31.75,245.11 24.38,245.11 21.84,247.65 21.84,260.35 23.88,262.38 26.92,262.38 49.28,284.73 82.3,284.73 83.95,283.08 83.95,271.91 SL-245.5
  Bottom 0.4: AL3.A 153.92,22.35 128.52,22.35 125.86,19.68 119,19.68 117.09,21.59 117.09,28.45 118.24,29.59 Z-A-245.14 | ACC-A-245.14 124.59,205.87 124.59,219.46 114.55,229.49 95.63,229.49 SR-245.7 | Y-A-245.14 116.2,82.55 116.2,77.72 117.6,76.33 120.78,76.33 124.33,79.88 124.33,97.66 125.98,99.31 156.21,99.31 157.73,97.79 160.02,97.79 161.29,99.06 NOT-L-04.1 | AND-L-08.9 157.48,151.13 152.15,145.8 120.78,145.8 X-A-245.14
A4
  Top 0.4: A.4 151.13,3.81 148.59,6.35 148.59,17.02 AL4.A | SL-245.4 83.31,262.13 83.31,228.6 85.98,225.93 108.71,225.93 114.55,220.09 114.55,204.72 116.08,203.2 ACC-A-245.15 | NOT-H-04.9 157.48,134.62 145.29,146.81 X-A-245.15
  Route2 0.4: Z-A-245.15 122.94,35.81 122.94,47.24 121.03,49.15 118.49,49.15 116.59,51.05 116.59,70.74 115.57,71.75 115.57,87 116.71,88.14 Y-A-245.15
  Route15 0.4: Y-A-245.15 122.94,91.82 122.94,103.38 121.28,105.03 119.76,105.03 116.59,108.2 116.59,127.51 115.19,128.91 115.19,145.29 116.71,146.81 X-A-245.15 123.06,150.62 123.06,161.93 117.47,167.51 117.47,186.82 115.44,188.85 115.44,202.18 116.46,203.2 ACC-A-245.15 129.54,203.2 130.81,204.47 ADDER-H-86.2 135.89,204.6 137.92,206.63 137.92,221.49 138.68,222.25 143.38,222.25 149.35,228.22 154.69,228.22 156.46,230 156.46,232.41 155.19,233.68 OR-H-32.2 | SL-245.4 84.84,270.26 84.84,283.34 82.55,285.62 48.9,285.62 26.54,263.27 23.5,263.27 20.95,260.73 20.95,240.66 XOR-H-86.2
  Bottom 0.4: AL4.A 148.08,21.59 128.91,21.59 126.11,18.8 118.87,18.8 115.57,22.1 115.57,31.37 116.33,32.13 Z-A-245.15 | ACC-A-245.15 123.7,207.52 123.7,219.33 114.43,228.6 93.98,228.6 SR-245.6 | AND-H-08.2 143.51,158.75 143.51,151.13 139.19,146.81 X-A-245.15 | CMP-H-85.9 20.32,194.31 23.11,197.1 23.11,235.08 24.26,236.22 XOR-H-86.2
A5
  Top 0.4: A.3 147.32,3.81 147.32,15.75 AL5.A | SL-245.3 82.55,260.35 82.55,237.49 81.28,236.22 78.74,236.22 78.11,236.85 78.11,238.51 79.63,240.03 SR-245.5 | NOT-H-04.11 156.21,132.08 156.21,134.62 145.41,145.41 117.73,145.41 117.22,145.92 117.22,148.08 118.49,149.35 X-A-245.16
  Route2 0.4: Z-A-245.16 120.4,34.67 122.17,36.45 122.17,46.74 121.03,47.88 117.22,47.88 115.7,49.4 115.7,70.48 114.81,71.37 114.81,89.53 115.95,90.68 Y-A-245.16
  Route15 0.4: Y-A-245.16 122.17,93.6 122.17,102.87 121.03,104.01 119.25,104.01 115.7,107.57 115.7,127.13 114.55,128.27 114.55,147.7 116.33,149.48 119.13,149.48 X-A-245.16 122.43,152.53 122.43,161.54 116.84,167.13 116.84,186.44 114.81,188.47 114.81,204.98 115.57,205.74 ACC-A-245.16 129.54,205.74 130.81,207.01 130.81,210.82 132.08,212.09 | 132.08,212.09 ADDER-H-86.5 | OR-H-32.5 155.32,241.3 156.4,240.22 156.4,236.28 155.07,234.95 152.65,234.95 151.64,233.93 151.64,232.79 152.02,232.41 154.69,232.41 155.57,231.52 155.57,230.38 154.43,229.24 149.1,229.24 142.88,223.01 135.89,223.01 131.95,219.07 131.95,212.22 132.08,212.09 | XOR-H-86.5 20.07,233.93 20.07,261.24 22.99,264.16 25.91,264.16 48.13,286.38 83.19,286.38 85.6,283.97 85.6,268.48 SL-245.3
  Bottom 0.4: AL5.A 139.06,19.05 137.16,20.95 129.92,20.95 127,18.03 118.62,18.03 114.81,21.84 114.81,33.53 115.95,34.67 Z-A-245.16 | SR-245.5 92.33,227.71 113.92,227.71 122.81,218.82 122.81,209.17 ACC-A-245.16 | AND-H-08.5 134.37,157.23 122.17,157.23 120.65,155.7 117.86,155.7 117.35,155.19 117.35,151.26 X-A-245.16 | XOR-H-86.5 27.3,230.5 27.3,239.52 26.54,240.28 23.5,240.28 22.23,239.01 22.23,200.03 21.59,199.39 CMP-H-85.11
A6
  Top 0.4: AL6.A 138.43,18.03 138.43,6.35 139.7,5.08 143.51,5.08 A.2 | SL-245.2 81.68,258.68 81.68,239.16 SR-245.4 | NOT-H-04.13 155.07,128.14 155.07,134.24 146.3,143 117.73,143 116.33,144.4 116.33,150.62 117.6,151.89 X-A-245.17
  Route2 0.4: Y-A-245.17 116.84,93.22 114.17,90.55 114.17,70.99 114.94,70.23 114.94,48.64 116.59,46.99 120.65,46.99 121.41,46.23 121.41,39.37 Z-A-245.17
  Route15 0.4: Y-A-245.17 121.16,95.12 121.16,102.62 120.65,103.12 118.87,103.12 114.94,107.06 114.94,126.75 113.92,127.76 113.92,150.88 114.94,151.89 X-A-245.17 121.79,154.43 121.79,161.29 116.2,166.88 116.2,185.8 114.17,187.83 114.17,206.88 115.57,208.28 ACC-A-245.17 120.65,207.01 ADDER-H-86.12 130.05,208.79 130.05,213.74 131.06,214.76 131.06,219.84 135.13,223.9 142.49,223.9 148.59,230 148.59,235.2 147.57,236.22 OR-H-32.12 | SL-245.2 86.49,266.83 86.49,284.73 84.07,287.15 47.75,287.15 25.65,265.05 22.73,265.05 19.18,261.49 19.18,232.28 24.13,227.33 26.67,227.33 XOR-H-86.12
  Bottom 0.4: AL6.A 136.27,20.19 130.18,20.19 127.25,17.27 118.36,17.27 114.05,21.59 114.05,36.07 115.19,37.21 Z-A-245.17 | SR-245.4 90.68,226.82 113.54,226.82 122.05,218.31 122.05,210.95 ACC-A-245.17 | AND-H-08.12 142.24,151.76 141.1,150.62 124.33,150.62 123.06,151.89 X-A-245.17 | CMP-H-85.14 20.32,207.01 21.46,208.15 21.46,240.03 22.35,240.92 27.05,240.92 28.07,239.9 28.07,234.82 29.21,233.68 XOR-H-86.12
A7
  Top 0.4: A.1 135.89,2.54 132.08,6.35 132.08,17.78 AL7.A | NOT-H-04.1 162.18,121.92 160.91,123.19 157.48,123.19 153.92,126.75 153.92,130.94 144.4,140.46 117.86,140.46 115.19,143.13 115.19,153.29 116.33,154.43 X-A-245.18
  Route2 0.4: Z-A-245.18 115.06,39.75 114.3,40.51 114.3,69.85 113.54,70.61 113.54,93.85 115.44,95.76 Y-A-245.18
  Route15 0.4: Y-A-245.18 115.06,95.76 113.79,97.03 113.79,126.49 113.28,127 113.28,153.29 114.43,154.43 X-A-245.18 121.03,156.21 121.03,160.91 115.57,166.37 115.57,185.42 113.41,187.58 113.41,209.17 115.06,210.82 ACC-A-245.18 123.19,214.63 ADDER-H-86.9 129.54,214.63 130.18,215.26 130.18,220.34 134.62,224.79 142.24,224.79 147.83,230.38 147.83,234.19 147.07,234.95 144.53,234.95 144.02,235.46 144.02,236.47 145.03,237.49 147.45,237.49 148.46,238.51 148.46,242.7 147.32,243.84 OR-H-32.9 | XOR-H-86.9 31.75,224.79 24.13,224.79 18.29,230.63 18.29,261.87 22.23,265.81 24.89,265.81 46.99,287.91 84.58,287.91 87.38,285.12 87.38,242.32 SR-245.3
  Bottom 0.4: AL7.A 128.27,16.51 118.11,16.51 113.41,21.21 113.41,38.48 114.68,39.75 Z-A-245.18 | SR-245.3 88.9,226.06 113.03,226.06 121.28,217.81 121.28,212.72 ACC-A-245.18 | AND-H-08.9 132.59,154.43 X-A-245.18 | XOR-H-86.9 35.56,228.6 35.56,233.68 34.29,234.95 30.48,234.95 29.21,236.22 29.21,240.03 27.43,241.81 21.97,241.81 20.32,240.16 20.32,214.63 19.05,213.36 12.7,213.36 CMP-H-85.1
A<B
  Route2 0.4: CMP-L-85.7 27.94,196.85 26.67,198.12 10.16,198.12 3.81,204.47 CMP0.2 CMP-H-85.2
A=B
  Route2 0.4: CMP-L-85.6 21.59,199.39 20.32,200.66 10.16,200.66 6.35,204.47 CMP1.2 CMP-H-85.3
A>B
  Route2 0.4: CMP-L-85.5 21.59,201.93 20.32,203.2 12.7,203.2 CMP-H-85.4 CMP2.2
ACC0
  Top 0.4: ACC-273.2 66.8,211.46 66.8,197.61 65.53,196.34 ACC-B-245.11 49.4,193.17 45.72,196.85 CMP-L-85.10 | ACC-A-245.9 109.86,193.68 109.86,191.9 111.25,190.5 114.3,190.5 ACC0.2 121.92,182.88 143.51,182.88 144.27,183.64 144.27,184.91 145.29,185.93 154.43,185.93 ADDER-L-283.5
  Route2 0.4: XOR-L-86.1 24.13,259.08 20.07,255.02 20.07,220.6 24,216.66 49.53,216.66 52.96,213.23 52.96,200.79 60.58,193.17 ACC-B-245.11
  Route15 0.4: AND-L-08.1 170.18,161.29 168.91,162.56 158.75,162.56 156.21,165.1 ADDER-L-283.5 | ACC-A-245.9 111.12,195.58 104.65,202.06 104.65,234.95 124.59,254.89 152.15,254.89 160.66,246.38 OR-L-32.1
  Bottom 0.4: ACC-B-245.11 72.26,186.44 91.31,186.44 97.16,192.28 97.16,194.94 97.79,195.58 ACC-A-245.9
ACC1
  Top 0.4: ACC-273.5 75.69,213.87 74.93,214.63 72.39,214.63 71.75,214 71.75,210.69 69.34,208.28 69.34,198.88 68.07,197.61 ACC-B-245.12 68.07,192.66 66.67,191.26 39.75,191.26 37.47,193.55 37.47,200.91 38.48,201.93 CMP-L-85.12 | ACC1.2 114.05,186.94 111.63,189.36 110.74,189.36 108.84,191.26 108.84,195.2 ACC-A-245.8 | ACC1.2 117.35,180.97 150.5,180.97 151.13,181.61 ADDER-L-283.3 | AND-L-08.4 162.56,158.75 159.51,155.7 127.76,155.7 115.32,168.15 115.32,180.59 114.05,181.86 ACC1.2
  Route2 0.4: ACC-B-245.12 66.34,194.9 60.37,194.9 53.98,201.29 53.98,213.74 50.04,217.68 24.38,217.68 20.95,221.11 20.95,247.01 XOR-L-86.4
  Route15 0.4: OR-L-32.4 160.53,240.79 160.53,245.11 151.64,254 125.09,254 105.66,234.57 105.66,202.95 110.49,198.12 ACC-A-245.8
  Bottom 0.4: ACC-B-245.12 73.91,187.32 91.06,187.32 96.39,192.66 96.39,196.72 97.79,198.12 ACC-A-245.8
ACC2
  Top 0.4: ACC-273.6 77.85,212.72 71.75,206.63 71.75,197.49 70.61,196.34 ACC-B-245.13 70.61,191.77 69.34,190.5 39.12,190.5 36.7,192.91 36.7,203.07 38.1,204.47 CMP-L-85.13 | ACC-A-245.7 107.44,196.34 ACC2.2 108.71,183.01 108.71,164.34 111.76,161.29 120.65,161.29 124.46,157.48 124.46,156.21 126.11,154.56 165.48,154.56 AND-L-08.13
  Route2 0.4: ACC2.2 109.47,182.25 137.03,182.25 137.79,183.01 137.79,188.72 138.94,189.87 149.22,189.87 ADDER-L-283.14 | XOR-L-86.13 31.75,256.54 30.23,255.02 30.23,242.32 28.83,240.92 23.75,240.92 21.72,238.89 21.72,221.74 24.89,218.57 50.67,218.57 54.86,214.38 54.86,201.68 60.83,195.71 68.07,195.71 ACC-B-245.13
  Route15 0.4: ACC-A-245.7 106.93,205.49 106.93,234.06 125.86,252.98 150.88,252.98 159.64,244.22 159.64,230.89 160.78,229.74 165.48,229.74 167.51,231.78 167.51,242.06 169.29,243.84 OR-L-32.13
  Bottom 0.4: ACC-A-245.7 96.52,200.66 95.5,199.64 95.5,193.04 90.68,188.21 75.56,188.21 ACC-B-245.13
ACC3
  Top 0.4: ACC-273.9 84.58,211.46 84.58,209.55 82.17,207.14 79.63,207.14 76.96,204.47 76.96,198.88 73.15,195.07 ACC-B-245.14 73.15,193.04 69.85,189.74 38.48,189.74 35.81,192.41 35.81,205.99 CMP-L-85.15 | ACC3.2 104.39,184.28 106.17,186.06 106.17,197.61 ACC-A-245.6
  Route2 0.4: ADDER-L-283.12 153.42,188.98 139.57,188.98 138.56,187.96 138.56,182.75 137.16,181.36 103.76,181.36 ACC3.2 100.84,181.1 102.87,179.07 102.87,167.64 104.27,166.24 122.17,166.24 123.95,164.47 146.56,164.47 148.59,162.43 148.59,158.75 153.16,154.18 158.24,154.18 AND-L-08.10 | ACC-B-245.14 73.15,193.93 70.74,196.34 61.72,196.34 55.75,202.31 55.75,215.01 51.31,219.46 25.4,219.46 22.61,222.25 22.61,238.51 24.13,240.03 29.21,240.03 31.11,241.94 31.11,247.01 XOR-L-86.10
  Route15 0.4: ACC-A-245.6 107.7,207.26 107.7,233.81 126.11,252.22 150.5,252.22 158.12,244.6 158.12,230.38 159.64,228.85 166.75,228.85 168.4,230.5 168.4,234.44 OR-L-32.10
  Bottom 0.4: ACC-B-245.14 77.22,189.1 90.3,189.1 94.61,193.42 94.61,202.56 95.25,203.2 ACC-A-245.6
ACC4
  Top 0.4: ACC-A-245.5 105.03,199.01 105.03,187.07 103.63,185.67 95.76,185.67 ACC4.2 | CMP-H-85.10 26.67,196.85 34.67,188.85 71.37,188.85 ACC-B-245.15
  Route2 0.4: ADDER-H-283.5 154.94,203.2 154.94,198.12 152.4,195.58 140.97,195.58 139.7,194.31 139.7,193.04 137.16,190.5 134.62,190.5 132.08,187.96 127.38,187.96 124.84,185.42 95.5,185.42 ACC4.2 92.71,182.63 92.71,169.54 97.16,165.1 121.67,165.1 123.32,163.45 145.92,163.45 147.32,162.05 AND-H-08.1 | XOR-H-86.1 23.5,236.85 23.5,222.88 25.91,220.47 51.69,220.47 56.52,215.65 56.52,202.82 62.23,197.1 74.17,197.1 75.69,195.58 ACC-B-245.15
  Route15 0.4: ACC-A-245.5 110.36,205.74 108.58,207.52 108.58,233.43 126.62,251.46 145.29,251.46 150.37,246.38 150.37,241.43 151.76,240.03 154.94,240.03 155.57,239.4 155.57,238.38 154.69,237.49 151.13,237.49 150.37,236.73 150.37,231.9 151.13,231.14 OR-H-32.1
  Bottom 0.4: ACC-273.12 87.12,219.07 87.12,199.52 85.72,198.12 77.47,198.12 75.69,196.34 ACC-B-245.15 78.99,189.87 89.92,189.87 93.85,193.8 93.85,204.34 95.25,205.74 ACC-A-245.5
ACC5
  Top 0.4: ACC5.2 92.2,184.28 94.61,186.69 103,186.69 104.01,187.71 104.01,200.53 ACC-A-245.4 | ACC-B-245.16 73.15,188.09 22.61,188.09 17.27,193.42 17.27,200.66 18.54,201.93 CMP-H-85.12
  Route2 0.4: ADDER-H-283.3 151.13,200.66 146.94,196.47 140.84,196.47 137.41,193.04 134.75,193.04 132.21,190.5 127,190.5 126.36,189.87 126.36,187.96 124.59,186.18 89.53,186.18 ACC5.2 85.09,181.74 85.09,170.94 86.23,169.8 90.3,169.8 96.01,164.08 121.03,164.08 123.32,161.8 123.32,157.48 124.59,156.21 135.89,156.21 AND-H-08.4 | ACC-B-245.16 78.23,196.6 76.96,197.87 62.61,197.87 57.4,203.07 57.4,216.15 52.32,221.23 31.62,221.23 30.35,222.5 30.35,228.47 27.69,231.14 XOR-H-86.4
  Route15 0.4: OR-H-32.4 151.13,238.76 149.35,240.54 149.35,246 144.78,250.57 127.13,250.57 109.6,233.04 109.6,209.17 110.49,208.28 ACC-A-245.4
  Bottom 0.4: ACC-273.15 78.23,220.6 80.01,222.38 88.9,222.38 90.04,221.23 90.04,199.39 87.76,197.1 81.92,197.1 78.23,193.42 ACC-B-245.16 80.77,190.63 89.66,190.63 93.09,194.06 93.09,206.76 94.61,208.28 ACC-A-245.4
ACC6
  Top 0.4: ACC-A-245.3 103,202.06 103,188.59 102.23,187.83 93.73,187.83 91.57,185.67 82.42,185.67 ACC6.2 | CMP-H-85.13 16.38,201.8 16.38,193.04 22.1,187.32 73.41,187.32 77.09,191.01 78.61,191.01 ACC-B-245.17
  Route2 0.4: ADDER-H-283.14 149.86,210.82 149.86,200.66 146.56,197.36 140.34,197.36 138.56,195.58 134.62,195.58 132.08,193.04 127,193.04 125.6,191.64 125.6,188.34 124.21,186.94 83.69,186.94 ACC6.2 82.3,183.01 82.3,169.54 83.06,168.78 89.66,168.78 95.5,162.94 120.52,162.94 122.43,161.04 122.43,156.59 123.7,155.32 141.86,155.32 AND-H-08.13 | ACC-B-245.17 80.77,197.61 79.88,198.5 63.12,198.5 58.17,203.45 58.17,216.79 52.7,222.25 31.88,222.25 31.24,222.88 31.24,234.44 XOR-H-86.13
  Route15 0.4: OR-H-32.13 140.84,233.68 137.03,237.49 125.73,237.49 122.81,234.57 122.81,223.39 114.3,214.88 114.3,213.36 ACC-A-245.3
  Bottom 0.4: ACC-273.16 78.49,223.14 89.28,223.14 90.81,221.62 90.81,198.75 88.27,196.22 82.8,196.22 80.77,194.18 ACC-B-245.17 80.77,192.53 81.92,191.39 89.41,191.39 92.33,194.31 92.33,209.17 93.98,210.82 ACC-A-245.3
ACC7
  Top 0.4: ACC7.2 78.99,184.28 81.41,186.69 90.93,186.69 93.22,188.98 101.47,188.98 101.98,189.48 101.98,203.58 ACC-A-245.2 | CMP-H-85.15 15.49,205.99 15.49,192.66 21.72,186.44 73.53,186.44 76.58,189.48 79.63,189.48 ACC-B-245.18
  Route2 0.4: ACC7.2 74.61,184.47 | 74.61,184.47 77.85,187.71 123.83,187.71 124.84,188.72 124.84,193.04 127.38,195.58 132.08,195.58 134.62,198.12 140.97,198.12 144.78,201.93 144.78,213.36 147.32,215.9 152.4,215.9 ADDER-H-283.12 | AND-H-08.10 135.25,154.31 123.06,154.31 121.41,155.96 121.41,160.66 120.14,161.93 95.12,161.93 89.15,167.89 79.88,167.89 75.95,171.83 75.95,183.13 74.61,184.47 | ACC-B-245.18 83.31,197.36 81.53,199.14 63.75,199.14 59.18,203.71 59.18,217.3 48.9,227.58 34.04,227.58 XOR-H-86.10
  Route15 0.4: ACC-A-245.2 121.92,223.52 121.92,234.95 127,240.03 140.97,240.03 142.24,241.3 OR-H-32.10
  Bottom 0.4: ACC-273.19 71.75,224.03 89.53,224.03 91.57,222 91.57,213.36 | 91.57,213.36 91.57,198.25 88.52,195.2 83.69,195.2 83.31,194.82 ACC-B-245.18 | ACC-A-245.2 91.57,213.36
ACC-A
  Route14 0.4: CTRL-1.2 200.41,64.52 200.41,220.6 197.74,223.27 86.36,223.27 84.58,221.49 84.58,191.01 85.09,190.5 88.9,190.5 90.17,191.77 90.17,208.28 96.52,214.63 118.11,214.63 ACC-A-245.19
ACC-B
  Route14 0.4: ACC-B-245.19 85.85,197.74 87.12,199.01 87.12,221.62 88.01,222.5 89.92,222.5 90.42,222 196.6,222 199.39,219.2 199.39,66.04 CTRL-1.1
ACC-CLR
  Top 0.4: ACC-C.2 63.25,212.09 62.74,212.6 | 62.74,212.6 ACC-CLR.1 | ACC-273.1 65.41,212.6 62.74,212.6
ACC-CP
  Route14 0.4: CTRL-0.10 196.85,64.77 197.74,65.66 197.74,218.82 195.58,220.98 89.03,220.98 ACC-273.11
ACCL0
  Bottom 0.4: ACC0.1 ACCL0.A
ACCL1
  Bottom 0.4: ACC1.1 ACCL1.A
ACCL2
  Bottom 0.4: ACC2.1 ACCL2.A
ACCL3
  Bottom 0.4: ACC3.1 ACCL3.A
ACCL4
  Bottom 0.4: ACCL4.A 94.23,176.53 ACC4.1
ACCL5
  Bottom 0.4: ACC5.1 ACCL5.A
ACCL6
  Bottom 0.4: ACCL6.A ACC6.1
ACCL7
  Bottom 0.4: ACC7.1 ACCL7.A
ADDER0
  Top 0.4: ADDER0.2 ADDER-L-283.4
  Route2 0.4: ADDER-L-283.4 153.67,185.42 155.19,186.94 162.69,186.94 | ADDER-B-245.9 142.49,239.78 142.49,226.57 145.03,224.03 168.66,224.03 172.97,219.71 172.97,197.23 162.69,186.94 | 162.69,186.94 177.8,186.94 178.69,186.06 ZERO-L1-02.2
ADDER1
  Top 0.4: ADDER1.2 ADDER-L-283.1
  Route2 0.4: ADDER-B-245.8 141.6,238.12 141.6,226.06 144.53,223.14 168.4,223.14 172.09,219.46 172.09,197.49 162.43,187.83 149.73,187.83 ADDER-L-283.1 | ADDER1.2 147.45,180.72 177.55,180.72 ZERO-L1-02.3
ADDER2
  Top 0.4: ADDER-L-283.13 153.67,195.58 ADDER2.2
  Route2 0.4: ADDER-B-245.7 140.59,236.6 140.59,225.68 144.27,222 168.02,222 171.07,218.95 171.07,202.82 162.56,194.31 161.29,194.31 157.48,198.12 ADDER2.2
  Route15 0.4: ZERO-L1-02.5 184.4,186.31 156.59,186.31 153.67,189.23 ADDER-L-283.13
ADDER3
  Top 0.4: ADDER3.2 ADDER-L-283.10
  Route2 0.4: ADDER-B-245.6 139.7,234.95 139.7,225.04 143.76,220.98 167.64,220.98 170.18,218.44 170.18,203.2 167.13,200.15 162.56,200.15 161.29,198.88 ADDER3.2
  Route15 0.4: ADDER-L-283.10 161.29,189.23 163.45,187.07 187.58,187.07 188.85,185.8 ZERO-L1-02.6
ADDER4
  Top 0.4: ADDER4.2 ADDER-H-283.4
  Route2 0.4: ADDER-B-245.5 138.68,233.43 138.68,224.66 143.51,219.84 155.07,219.84 157.48,217.42 157.48,210.31 153.67,206.5 ADDER-H-283.4
  Route15 0.4: ZERO-L1-02.8 191.39,194.56 185.29,200.66 154.94,200.66 ADDER4.2
ADDER5
  Top 0.4: ADDER5.2 ADDER-H-283.1
  Route2 0.4: ADDER5.2 142.11,205.74 142.11,216.66 134.11,224.66 134.11,231.9 ADDER-B-245.4
  Route15 0.4: ZERO-L1-02.9 188.85,194.56 183.51,199.9 156.34,199.9 154.81,198.37 150.24,198.37 146.05,202.56 ADDER-H-283.1
ADDER6
  Route2 0.4: ADDER6.2 143.26,218.69 137.79,224.16 137.79,230.5 137.16,231.14 ADDER-B-245.3
  Route15 0.4: ADDER6.2 ADDER-H-283.13
  Bottom 0.4: ZERO-L1-02.11 183.77,193.42 167.64,209.55 163.83,209.55 162.56,210.82 162.56,213.36 160.02,215.9 155.92,215.9 153.67,213.65 ADDER-H-283.13
ADDER7
  Top 0.4: ADDER-H-283.10 ADDER7.2 157.48,217.17 153.67,220.98 140.97,220.98 137.79,224.16 137.79,227.2 136.4,228.6 ADDER-B-245.2
  Route14 0.4: FLAGS.6 196.85,31.75 198.12,33.02 198.12,59.69 201.55,63.12 201.55,221.36 198.12,224.79 139.7,224.79 ADDER-B-245.2
  Bottom 0.4: ADDER-H-283.10 161.29,210.82 163.83,208.28 167.64,208.28 181.23,194.69 ZERO-L1-02.12
ADDER-B
  Route3 0.4: CTRL-1.4 194.31,54.61 192.66,56.26 192.66,160.4 186.31,166.75 141.86,166.75 126.24,182.37 126.24,226.57 ADDER-B-245.19
AL0
  Bottom 0.4: AL0.K A0.2
AL1
  Bottom 0.4: AL1.K A1.2
AL2
  Bottom 0.4: AL2.K A2.2
AL3
  Bottom 0.4: AL3.K A3.2
AL4
  Bottom 0.4: AL4.K A4.2
AL5
  Bottom 0.4: AL5.K A5.2
AL6
  Bottom 0.4: A6.2 AL6.K
AL7
  Bottom 0.4: AL7.K A7.2
AND0
  Route2 0.4: AND-L-08.3 165.1,158.75 167.51,156.34 170.43,156.34 177.8,148.97 177.8,127 179.07,125.73 AND-B-245.9
  Bottom 0.4: AND-B-245.9 AND0.2
AND1
  Route2 0.4: AND-B-245.8 179.07,123.19 176.66,125.6 176.66,148.46 169.8,155.32 158.5,155.32 157.48,156.34 AND-L-08.6
  Bottom 0.4: AND1.2 AND-B-245.8
AND2
  Top 0.4: AND-L-08.11 162.56,144.91 175.64,131.83 175.64,121.54 176.53,120.65 AND-B-245.7
  Bottom 0.4: AND-B-245.7 AND2.2
AND3
  Top 0.4: AND-L-08.8 154.94,151.13 174.62,131.44 174.62,120.02 176.53,118.11 AND-B-245.6
  Bottom 0.4: AND3.2 AND-B-245.6
AND4
  Route15 0.4: AND-H-08.3 143.51,158.75 143.51,148.59 153.42,138.68 167.77,138.68 176.28,130.18 176.28,117.09 177.8,115.57 AND-B-245.5
  Bottom 0.4: AND-B-245.5 AND4.2
AND5
  Route2 0.4: AND-B-245.4 176.53,113.03 175.26,114.3 168.91,114.3 167.64,115.57 156.21,115.57 154.94,116.84 154.94,129.54 146.05,138.43 146.05,161.29 145.03,162.31 136.91,162.31 AND-H-08.6
  Bottom 0.4: AND5.2 AND-B-245.4
AND6
  Route2 0.4: AND-B-245.3 175.39,110.49 175.39,110.62 174.37,111.63 168.91,111.63 167.51,113.03 156.21,113.03 153.92,115.32 153.92,128.27 139.7,142.49 AND-H-08.11
  Bottom 0.4: AND-B-245.3 AND6.2
AND7
  Route2 0.4: AND-B-245.2 176.53,107.95 175.26,109.22 168.91,109.22 167.64,110.49 157.48,110.49 153.03,114.94 153.03,127.89 132.08,148.84 AND-H-08.8
  Bottom 0.4: AND7.2 AND-B-245.2
AND-B
  Route3 0.4: CTRL-1.5 194.31,52.07 191.64,54.74 191.64,103 187.96,106.68 173.99,106.68 AND-B-245.19
B0
  Top 0.4: Z-B-245.9 67.94,32.13 67.44,32.64 57.53,32.64 56.64,31.75 BL0.A | Y-B-245.9 67.94,85.6 67.94,97.03 Y-273.3 | ACC-B-245.9 68.07,210.31 70.48,212.72 ACC-273.3 | OR-B-245.11 119.38,259.08 120.02,259.71 122.81,259.71 123.32,259.21 123.32,253.87 ADDER-B-245.11
  Route2 0.4: Y-B-245.9 65.91,87.38 62.61,87.38 56.64,81.41 BL0.A | SR-245.11 64.14,244.47 64.14,218.82 70.23,212.72 ACC-273.3 | X-B-245.9 69.22,141.48 69.22,133.86 70.87,132.21 99.95,132.21 104.78,127.38 104.78,125.35 109.47,120.65 115.57,120.65 118.11,118.11 118.11,114.94 118.75,114.3 122.3,114.3 123.57,113.03 NOT-B-245.11
  Route15 0.4: X-B-245.9 66.17,144.53 58.17,144.53 56.64,143 BL0.A | SL-245.11 73.66,280.67 74.42,279.91 74.42,277.5 73.79,276.86 71.37,276.86 70.48,275.97 70.48,254.63 SR-245.11 | NOT-B-245.11 128.27,111.76 132.21,107.82 167.51,107.82 168.91,109.22 173.99,109.22 175.26,110.49 175.26,125.73 AND-B-245.11
  Bottom 0.4: Z-B-245.9 67.94,38.48 70.48,41.02 Z-273.3 | X-B-245.9 67.94,153.92 70.48,156.46 X-273.3 | ACC-B-245.9 68.07,201.93 67.31,202.69 61.21,202.69 56.64,198.12 BL0.A 55.12,28.19 55.12,17.02 46.86,8.76 B.8 | SL-245.11 73.03,280.67 76.83,276.86 80.83,276.86 89.53,268.16 89.53,255.91 96.52,248.92 ADDER-B-245.11 | XOR-B-245.11 43.18,251.46 68.58,251.46 69.85,252.73 SR-245.11
B1
  Top 0.4: Z-B-245.8 70.48,32.13 69.34,33.27 53.21,33.27 BL1.A | Y-273.4 70.48,97.03 70.48,85.6 Y-B-245.8 | ACC-B-245.8 70.61,207.77 73.15,210.31 ACC-273.4 | ADDER-B-245.12 121.92,252.73 OR-B-245.12
  Route2 0.4: Y-B-245.8 70.36,85.6 67.82,88.14 61.85,88.14 49.66,75.95 BL1.A | ACC-273.4 66.8,219.07 66.8,244.6 SR-245.12 | NOT-B-245.12 130.81,114.3 130.3,114.81 123.95,114.81 120.65,118.11 120.65,120.65 119.38,121.92 111.76,121.92 100.33,133.35 72.39,133.35 71.75,133.99 71.75,141.48 X-B-245.8
  Route15 0.4: X-B-245.8 67.94,145.29 57.66,145.29 49.66,137.29 BL1.A | SR-245.12 69.6,252.98 69.6,276.61 71.12,278.13 SL-245.12 | NOT-B-245.12 136.53,118.75 165.74,118.75 AND-B-245.12
  Bottom 0.4: Z-273.4 73.03,41.02 70.48,38.48 Z-B-245.8 | X-273.4 73.03,155.19 70.48,152.65 X-B-245.8 | ACC-B-245.8 67.82,203.58 60.96,203.58 49.66,192.28 BL1.A 48.26,28.32 48.26,16.51 B.7 | ADDER-B-245.12 95.76,246.38 88.52,253.62 88.52,267.08 81.28,274.32 76.07,274.32 74.55,275.84 74.55,277.37 73.79,278.13 SL-245.12 | SR-245.12 71.12,250.19 69.85,248.92 43.18,248.92 XOR-B-245.12
B2
  Top 0.4: Z-B-245.7 73.03,32.13 71.25,33.91 46.61,33.91 BL2.A | Y-273.7 78.49,101.22 77.34,101.22 76.58,100.46 76.58,97.92 72.9,94.23 Y-B-245.7 | ACC-B-245.7 73.15,206.5 77.47,210.82 78.87,210.82 ACC-273.7 | OR-B-245.13 130.3,251.97 130.3,245.87 ADDER-B-245.13
  Route2 0.4: Y-B-245.7 69.47,88.9 61.47,88.9 42.42,69.85 BL2.A | ACC-273.7 76.33,217.17 71.12,217.17 69.34,218.95 69.34,244.6 SR-245.13 | X-B-245.7 78.99,136.78 98.17,136.78 111.76,123.19 120.65,123.19 123.19,120.65 123.19,116.84 124.46,115.57 131.95,115.57 133.35,114.17 NOT-B-245.13
  Route15 0.4: BL2.A 42.42,131.57 56.9,146.05 69.72,146.05 X-B-245.7 | SL-245.13 77.6,270.38 77.6,225.93 78.74,224.79 84.45,224.79 87.12,222.12 87.12,211.2 86.61,210.69 82.42,210.69 80.77,212.34 ACC-273.7 | AND-B-245.13 167.51,117.98 138.3,117.98 NOT-B-245.13
  Bottom 0.4: Z-B-245.7 80.64,38.48 Z-273.7 | X-B-245.7 73.03,152.02 76.2,155.19 77.72,155.19 80.52,157.99 X-273.7 | ACC-B-245.7 69.6,204.34 60.45,204.34 42.42,186.31 BL2.A 40.64,27.94 40.64,11.43 B.6 | ADDER-B-245.13 96.52,243.84 87.63,252.73 87.63,265.43 81.28,271.78 76.2,271.78 SL-245.13 | XOR-B-245.13 43.18,246.38 69.85,246.38 71.12,247.65 SR-245.13
B3
  Top 0.4: Z-B-245.6 75.56,32.13 73.03,34.67 40.26,34.67 BL3.A | Y-B-245.6 75.56,85.6 75.56,94.36 78.11,96.9 80.64,96.9 82.93,99.19 Y-273.8 | ACC-B-245.6 75.69,205.23 78.74,208.28 81.28,208.28 83.31,210.31 ACC-273.8 | ADDER-B-245.14 130.3,241.3 131.06,242.06 131.06,253.75 OR-B-245.14
  Route2 0.4: Y-B-245.6 71.25,89.66 61.09,89.66 35.31,63.88 BL3.A | SR-245.14 76.2,241.3 76.2,226.06 78.74,223.52 82.55,223.52 84.58,221.49 84.58,214 ACC-273.8 | X-B-245.6 80.77,137.54 98.68,137.54 111.76,124.46 122.05,124.46 124.21,122.3 124.21,118.24 126.24,116.2 134.87,116.2 135.89,115.19 NOT-B-245.14
  Route15 0.4: X-B-245.6 71.5,146.81 56.39,146.81 35.31,125.73 BL3.A | SL-245.14 76.45,268.99 76.45,224.28 77.85,222.88 83.57,222.88 84.58,221.87 84.58,214 ACC-273.8 | AND-B-245.14 172.72,120.4 169.54,117.22 140.08,117.22 NOT-B-245.14
  Bottom 0.4: Z-273.8 83.19,39.75 75.56,32.13 Z-B-245.6 | X-B-245.6 75.56,151.13 77.98,153.54 80.39,153.54 83.19,156.34 X-273.8 | ACC-B-245.6 71.37,205.1 59.94,205.1 35.31,180.47 BL3.A 36.83,28.19 36.83,12.7 35.43,11.3 B.5 | ADDER-B-245.14 97.28,241.3 86.61,251.97 86.61,263.91 81.28,269.24 76.2,269.24 SL-245.14 | SR-245.14 71.12,245.11 69.85,243.84 43.18,243.84 XOR-B-245.14
B4
  Top 0.4: Z-B-245.5 78.11,32.13 74.8,35.43 33.78,35.43 BL4.A | ACC-B-245.5 78.23,204.22 80.14,206.12 83.31,206.12 87.12,209.93 87.12,214.38 83.31,218.19 ACC-273.13 | ADDER-B-245.15 130.81,238.76 131.83,239.78 131.83,255.52 OR-B-245.15
  Route2 0.4: Y-B-245.5 73.03,90.42 60.71,90.42 28.07,57.78 BL4.A | SR-245.15 75.31,239.65 75.31,223.65 76.83,222.12 82.17,222.12 83.31,220.98 ACC-273.13 | X-B-245.5 82.55,138.3 101.73,138.3 113.16,126.87 122.3,126.87 124.97,124.21 124.97,118.87 126.87,116.97 137.03,116.97 138.43,115.57 NOT-B-245.15
  Route15 0.4: BL4.A 28.07,119.76 55.88,147.57 73.28,147.57 X-B-245.5 | SL-245.15 75.44,267.46 75.44,223.52 76.96,222 76.96,218.82 77.6,218.19 82.04,218.19 83.31,219.46 ACC-273.13 | NOT-B-245.15 138.43,114.3 140.46,116.33 170.94,116.33 AND-B-245.15
  Bottom 0.4: Z-273.13 83.19,51.18 83.69,51.69 89.03,51.69 89.66,51.05 89.66,36.07 88.77,35.18 82.42,35.18 Z-B-245.5 | Y-273.13 79.12,103.12 79.12,97.92 77.98,96.77 Y-B-245.5 | X-B-245.5 78.11,150.75 79.88,152.53 83.06,152.53 87,156.46 87,159 83.19,162.81 X-273.13 | ACC-B-245.5 73.15,205.87 59.69,205.87 28.07,174.24 BL4.A 31.75,26.04 31.75,19.05 33.02,17.78 33.02,8.89 B.4 | SL-245.15 73.66,270.51 77.47,266.7 81.41,266.7 85.6,262.51 85.6,251.33 99.19,237.74 127.25,237.74 ADDER-B-245.15 | XOR-B-245.15 43.18,241.3 64.77,241.3 66.04,242.57 SR-245.15
B5
  Top 0.4: Z-B-245.4 80.64,32.13 76.71,36.07 27.43,36.07 BL5.A | ACC-B-245.4 80.77,202.69 82.93,204.85 84.2,204.85 89.92,210.57 89.92,221.62 89.15,222.38 82.8,222.38 ACC-273.14 | OR-B-245.16 132.59,257.3 132.59,237.49 131.32,236.22 ADDER-B-245.16
  Route2 0.4: Y-B-245.4 74.8,91.19 60.33,91.19 20.95,51.82 BL5.A | SR-245.16 73.03,240.03 74.3,238.76 74.3,218.44 74.55,218.19 78.61,218.19 ACC-273.14 | X-B-245.4 84.33,139.06 102.23,139.06 113.79,127.51 122.94,127.51 125.73,124.71 125.73,119.51 127.38,117.86 139.95,117.86 140.97,116.84 NOT-B-245.16
  Route15 0.4: X-B-245.4 75.06,148.34 55.5,148.34 20.95,113.79 BL5.A | SL-245.16 72.77,267.97 74.55,266.19 74.55,242.19 SR-245.16 | AND-B-245.16 142.24,115.57 140.97,114.3 NOT-B-245.16
  Bottom 0.4: Z-273.14 80.64,51.18 81.92,52.45 89.41,52.45 90.42,51.44 90.42,35.18 89.66,34.42 84.2,34.42 Z-B-245.4 | Y-B-245.4 81.15,86.11 81.15,97.16 81.66,97.66 81.66,103.12 84.2,105.66 84.2,108.58 83.57,109.22 82.68,109.22 Y-273.14 | X-273.14 80.64,166.5 81.66,167.51 89.15,167.51 89.79,166.88 89.79,156.97 84.58,151.76 82.17,151.76 80.64,150.24 X-B-245.4 | ACC-B-245.4 75.06,206.5 58.8,206.5 20.95,168.66 BL5.A 21.21,29.59 25.4,25.4 25.4,16.51 30.35,11.56 B.3 | ADDER-B-245.16 99.19,236.22 84.33,251.08 84.33,261.37 81.41,264.29 76.07,264.29 SL-245.16 | XOR-B-245.16 43.18,238.76 68.58,238.76 69.85,240.03 SR-245.16
B6
  Top 0.4: Z-B-245.3 83.19,32.13 78.49,36.83 21.08,36.83 BL6.A | ACC-273.17 76.07,223.27 89.66,223.27 90.68,222.25 90.68,209.93 83.31,202.56 ACC-B-245.3 | SL-245.17 70.23,263.27 70.23,238.63 71.37,237.49 SR-245.17 | OR-B-245.17 133.35,256.54 133.35,234.95 132.08,233.68 ADDER-B-245.17
  Route2 0.4: Y-B-245.3 76.58,91.95 59.94,91.95 13.97,45.97 BL6.A | ACC-273.17 70.36,223.14 70.36,235.46 SR-245.17 | X-B-245.3 85.98,139.95 102.74,139.95 114.3,128.4 123.32,128.4 126.75,124.97 126.75,119.63 127.76,118.62 142.11,118.62 143.51,117.22 NOT-B-245.17
  Route15 0.4: BL6.A 13.97,108.08 54.99,149.1 76.83,149.1 X-B-245.3 | NOT-B-245.17 145.16,114.68 154.81,114.68 156.46,113.03 AND-B-245.17
  Bottom 0.4: Z-273.17 76.33,53.21 89.79,53.21 91.19,51.82 91.19,34.67 90.17,33.66 85.98,33.66 Z-B-245.3 | Y-B-245.3 83.06,97.03 84.2,98.17 84.2,102.87 86.61,105.28 86.61,107.95 84.58,109.98 75.82,109.98 Y-273.17 | X-273.17 75.69,168.28 89.53,168.28 90.55,167.26 90.55,156.46 83.19,149.1 X-B-245.3 | ACC-B-245.3 76.83,207.26 58.29,207.26 13.97,162.94 BL6.A 13.97,29.21 22.86,20.32 22.86,16.51 27.81,11.56 B.2 | ADDER-B-245.17 127.89,233.3 100.71,233.3 83.44,250.57 83.44,259.46 81.28,261.62 76.2,261.62 SL-245.17 | XOR-B-245.17 43.18,236.22 64.77,236.22 66.04,237.49 SR-245.17
B7
  Top 0.4: Z-B-245.2 85.72,32.13 80.26,37.59 14.86,37.59 BL7.A | ACC-B-245.2 85.85,203.84 91.44,209.42 91.44,222.76 90.17,224.03 74.3,224.03 ACC-273.18 | SL-245.18 73.15,262.89 74.17,261.87 74.17,235.46 73.66,234.95 SR-245.18 | OR-B-245.18 137.16,253.11 134.11,250.06 134.11,232.03 133.22,231.14 ADDER-B-245.18
  Route2 0.4: Y-B-245.2 78.49,92.58 59.56,92.58 6.99,40.01 BL7.A | NOT-B-245.18 146.05,118.11 144.78,119.38 144.78,125.73 141.35,129.16 114.68,129.16 103.12,140.72 87.76,140.72 X-B-245.2
  Route15 0.4: X-B-245.2 76.58,151.89 56.52,151.89 6.99,102.36 BL7.A | AND-B-245.18 147.32,110.49 146.05,111.76 NOT-B-245.18
  Bottom 0.4: Z-273.18 74.55,53.98 90.17,53.98 92.08,52.07 92.08,34.42 90.42,32.77 86.36,32.77 85.72,32.13 Z-B-245.2 | Y-273.18 74.04,110.74 86.87,110.74 89.53,108.08 89.53,98.55 85.6,94.61 Y-B-245.2 | X-273.18 73.91,169.04 90.04,169.04 91.44,167.64 91.44,156.08 85.72,150.37 X-B-245.2 | ACC-B-245.2 78.61,208.03 59.44,208.03 | 59.44,208.03 57.66,208.03 6.99,157.35 BL7.A 19.05,17.65 19.05,14.99 B.1 | 59.44,208.03 59.44,222 SR-245.18 67.31,234.95 66.04,233.68 43.18,233.68 XOR-B-245.18 | ADDER-B-245.18 116.84,231.14 115.57,232.41 100.33,232.41 82.55,250.19 82.55,257.81 81.28,259.08 76.2,259.08 SL-245.18
BL0
  Top 0.4: B0.2 BL0.K
BL1
  Top 0.4: B1.2 BL1.K
BL2
  Top 0.4: B2.2 BL2.K
BL3
  Top 0.4: B3.2 BL3.K
BL4
  Top 0.4: B4.2 BL4.K
BL5
  Top 0.4: B5.2 BL5.K
BL6
  Top 0.4: B6.2 BL6.K
BL7
  Top 0.4: B7.2 BL7.K
C4
  Top 0.4: ADDER-H-283.7 161.29,203.2 162.56,201.93 162.56,193.04 ADDER-L-283.9
  Bottom 0.4: ADDER-L-283.9 ADDER-C4.2
CMP-CLR
  Bottom 0.4: CMP-R-273.1 CMP-CLR.1 CMP-R.1
CMP-CP
  Bottom 0.4: CMP-R-273.11 176.53,40.64 180.34,36.83 CTRL-3.1
EF
  Top 0.4: CMP-R-273.12 163.83,43.18 185.42,21.59 FLAGS.2
EQ
  Top 0.4: CMP4.2 7.62,185.55 9.65,185.55 13.97,189.87 13.97,196.85 CMP-H-85.6
  Route3 0.4: CMP4.2 6.48,186.82 7.62,187.96 10.16,187.96 11.43,186.69 11.43,96.01 60.07,47.37 138.05,47.37 138.43,46.99 147.32,46.99 148.59,45.72 CMP-R-273.13
GD
  Top 0.4: CMP-H-85.5 11.68,201.93 14.73,198.88 14.73,188.98 10.54,184.78 5.59,184.78 CMP3.2
  Route3 0.4: CMP-R-273.14 152.4,48.26 151.13,49.53 93.98,49.53 90.17,53.34 55.75,53.34 12.7,96.39 12.7,186.69 10.16,189.23 5.08,189.23 3.68,187.83 CMP3.2
GF
  Top 0.4: FLAGS.3 186.69,24.13 160.02,50.8 CMP-R-273.15
GND
  Top 0.4: Z-273.10 Z-B-245.1 88.27,29.59 87.63,28.96 64.26,28.96 64.14,28.83 | 64.14,28.83 64.14,24.38 B0.1 B1.1 B2.1 B3.1 B4.1 B5.1 B6.1 B7.1 6.99,10.79 PS.2 10.92,7.62 C6.- | 64.14,28.83 64.14,29.59 Z-B-245.10 65.02,31.24 Z-C.1 | Y-B-245.10 65.28,93.22 63.88,94.61 63.88,100.46 65.41,101.98 86.87,101.98 88.01,100.84 Y-273.10 88.14,99.19 Y-B-245.1 | Y-A-245.10 110.81,77.15 110.81,58.36 YL1.K 113.41,55.75 113.41,22.73 112.65,21.97 Z-A-245.10 | ACC-B-245.10 64.01,200.79 ACC-C.1 60.45,204.34 60.45,214.63 | ACC-B-245.1 88.39,205.23 97.79,214.63 | ACC-A-245.10 113.03,193.04 113.67,193.68 113.67,214 113.03,214.63 97.79,214.63 | 97.79,214.63 93.73,214.63 92.2,216.15 92.2,223.14 90.55,224.79 77.47,224.79 | 77.47,224.79 66.04,224.79 60.45,219.2 | 60.45,219.2 60.45,214.63 | YL4.K YL3.K | SR-245.2 78.74,232.41 | 78.74,232.41 77.47,231.14 | 77.47,224.79 77.47,231.14 | 78.74,232.41 77.47,233.68 77.47,251.46 78.74,252.73 SR-245.10 76.2,252.73 74.93,254 74.93,273.05 SL-245.9 SL-245.10 | ACCL0.K 121.92,172.72 121.92,176.53 125.48,180.09 159.77,180.09 ADDER-L-283.8 166.37,186.69 T3.1 166.37,196.34 | OVERFLOW.1 ADDER-H-283.8 161.93,206.38 158.24,206.38 157.48,205.61 | OVERFLOW.1 T4.1 166.37,198.12 | OVERFLOW.1 167.64,205.74 167.64,213.49 T7.1 166.37,217.17 | 166.37,196.34 166.37,198.12 | T5.1 157.48,203.2 157.48,205.61 | ADDER-L-86.7 134.11,201.17 134.11,215.39 ADDER-H-86.7 | T6.1 157.48,213.49 157.48,205.61 | ADDER2.1 166.37,198.12 | 166.37,196.34 ADDER3.1 175.9,203.33 C3.- | T0.1 ADDER0.1 T1.1 ADDER1.1 | ADDER6.1 161.42,218.57 | 161.42,218.57 162.81,217.17 166.37,217.17 | 166.37,217.17 ADDER7.1
  Top 0.4: NOT7.1 NOT6.1 NOT5.1 NOT4.1 NOT3.1 NOT2.1 NOT1.1 NOT0.1 130.43,130.43 128.27,128.27 NOT-B-245.10 120.65,113.03 XL0.K | NOT-L-04.7 168.28,116.2 168.28,135.25 NOT-H-04.7 | AND-B-245.10 187.45,128.27 AND0.1 | OR-H-32.7 156.21,243.84 156.21,236.22 161.29,231.14 OR-L-32.7 162.56,227.33 | 162.56,227.33 162.56,219.71 161.42,218.57 | 77.47,231.14 60.45,231.14 XOR7.1 XOR6.1 XOR5.1 XOR4.1 XOR3.1 XOR2.1 XOR1.1 XOR0.1 59.18,250.7 57.15,252.73 XOR-B-245.10 52.2,255.4 C7.- | CMP-L-85.2 36.83,214.63 60.45,214.63 | YL7.K 69.09,56.39 67.82,55.12 C2.- | C1.- 58.17,221.49 60.45,219.2 | 162.56,227.33 173.99,227.33 176.53,229.87 C8.-
  Route2 0.4: X-B-245.1 X-273.10 91.06,160.78 112.9,160.78 113.54,160.15 113.54,137.29 112.9,136.65 X-A-245.10 | ACC-B-245.1 88.39,201.93 87.5,202.82 67.56,202.82 ACC-B-245.10 | ADDER-H-86.7 134.62,218.44 133.22,218.44 | ACC-A-245.10 113.67,194.94 113.67,212.72 119.38,218.44 133.22,218.44 | ADDER5.1 143.38,213.74 146.43,216.79 155.57,216.79 156.21,216.15 T6.1 | ADDER-B-245.10 133.22,246.25 133.22,218.44 | CMP0.1 3.81,200.66 5.08,199.39 CMP1.1 CMP2.1 CMP-H-85.8
  Route15 0.4: AND-L-08.7 152.78,162.18 134.24,162.18 AND-H-08.7 | X-B-245.10 65.53,142.75 68.58,139.7 85.22,139.7 X-B-245.1 | T2.1 146.05,199.01 ADDER4.1 | Y-273.10 90.17,101.47 90.17,110.11 XL4.K | X-273.10 88.27,159.38 94.23,165.35 ACCL4.K